# EAGLE board PKG900000001400 (EAGLE 7.7.0), part 1 of 2
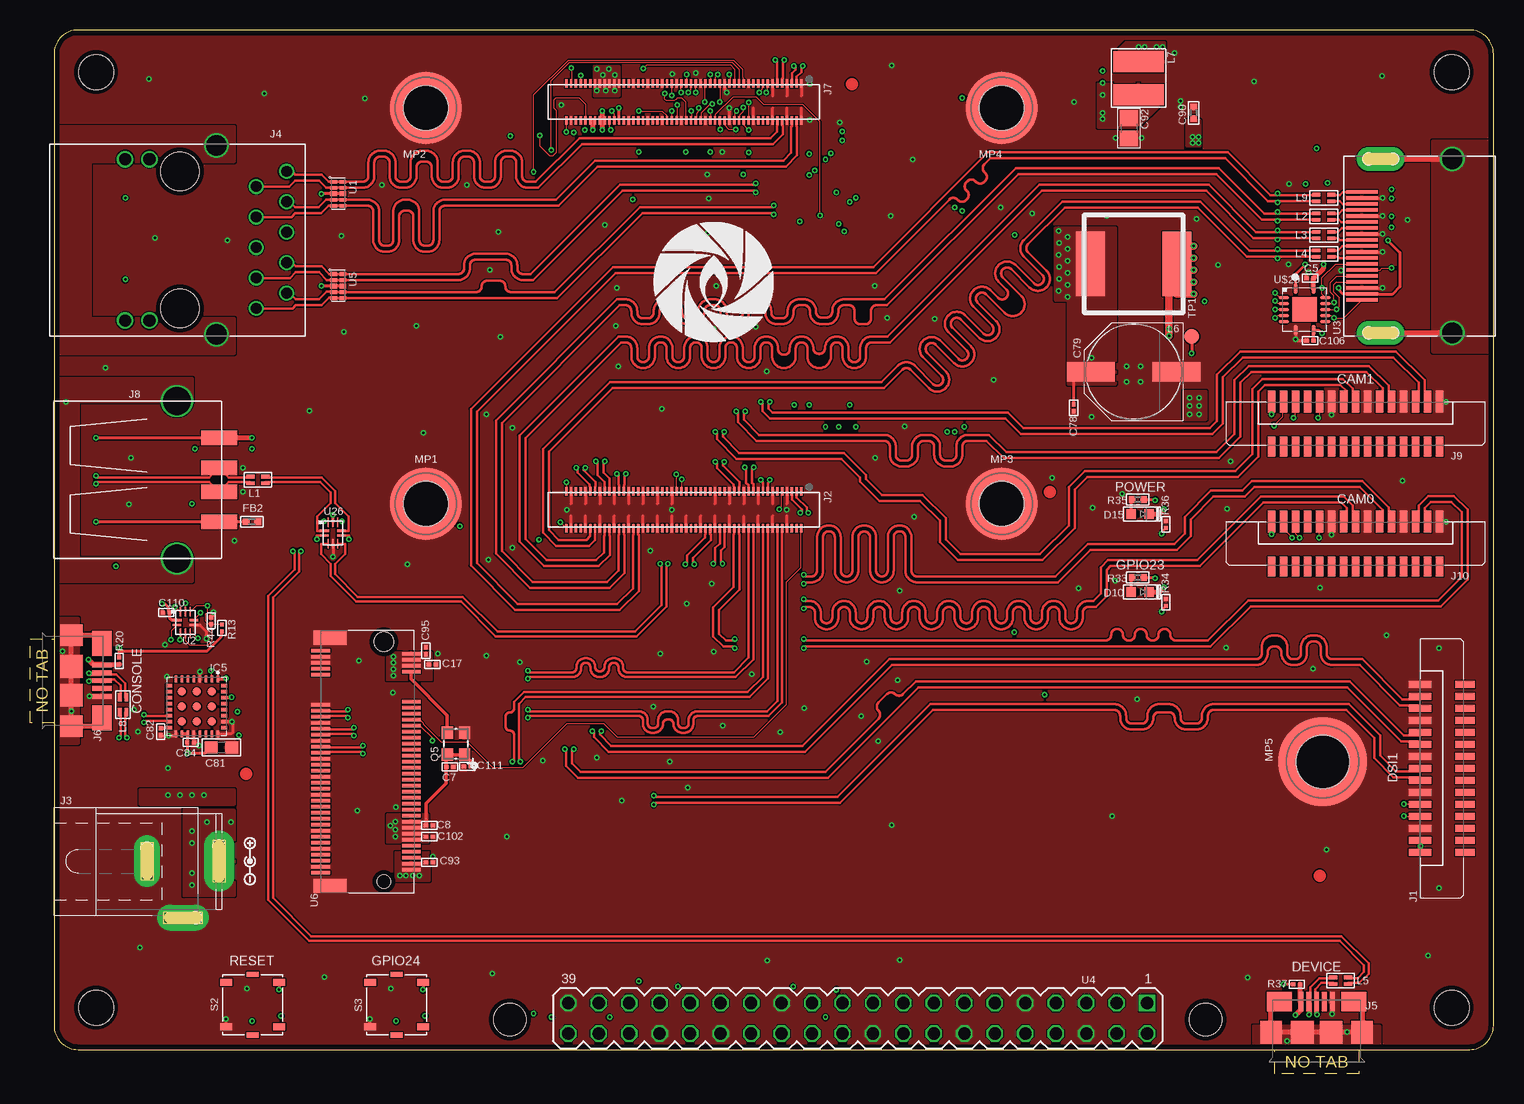
[diagram p23: board, top side]
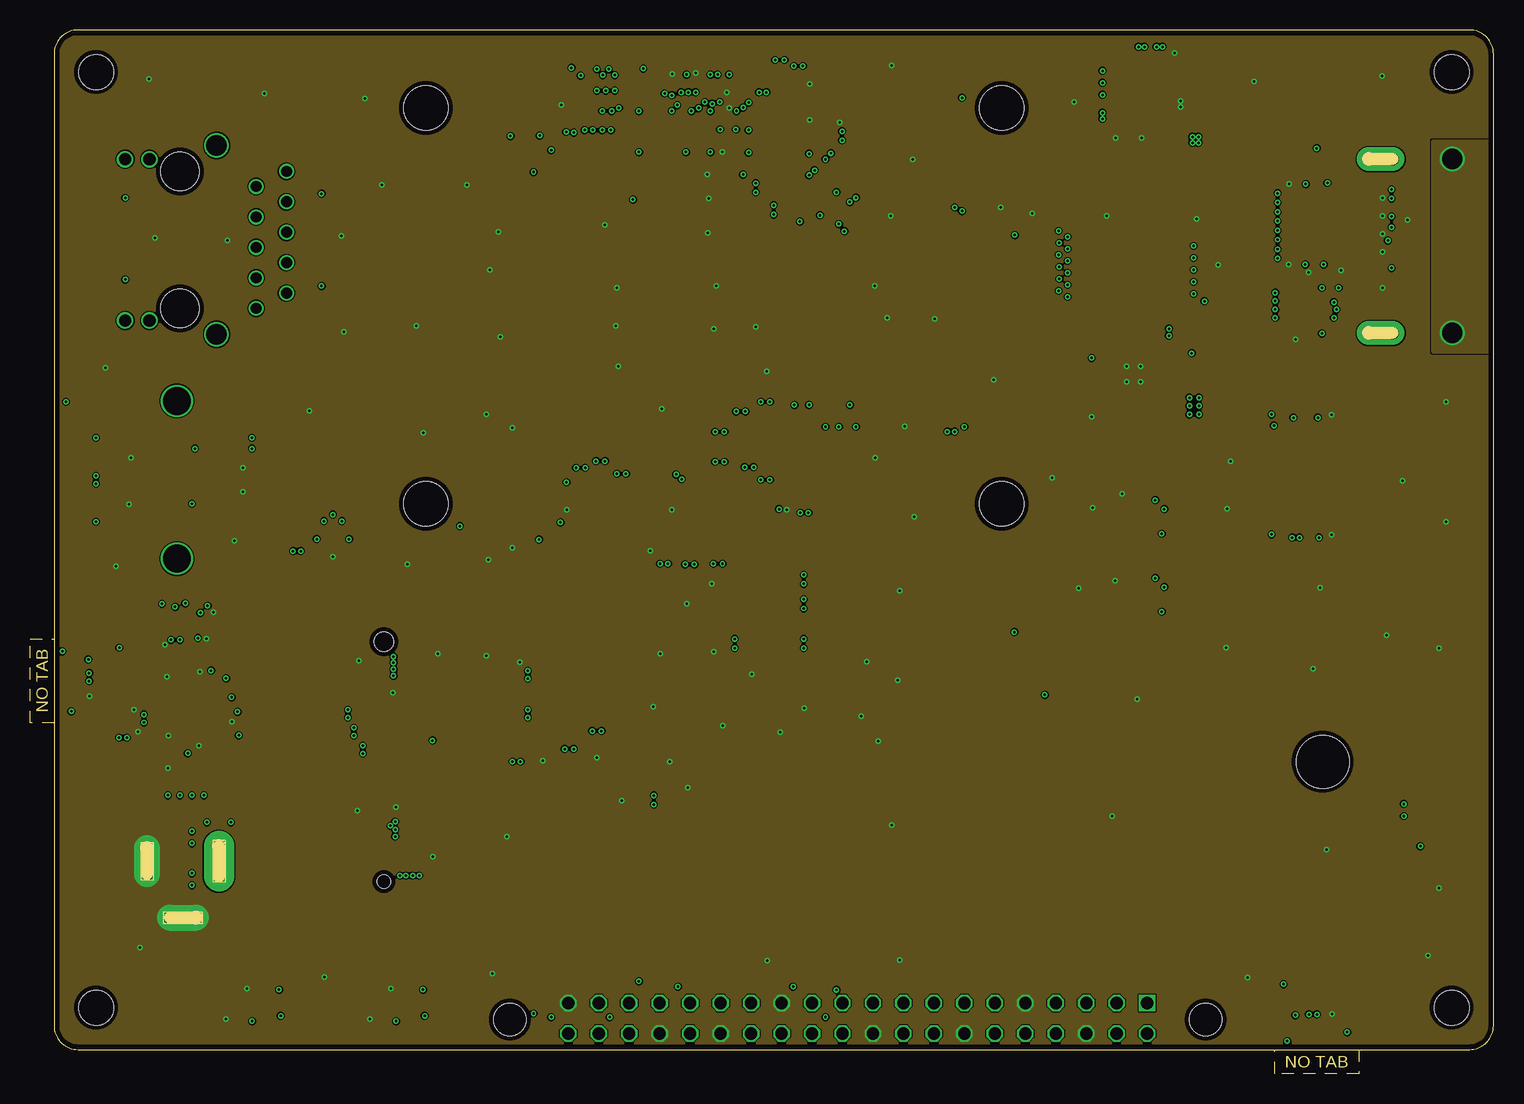
[diagram p24: board, inner layer GND]
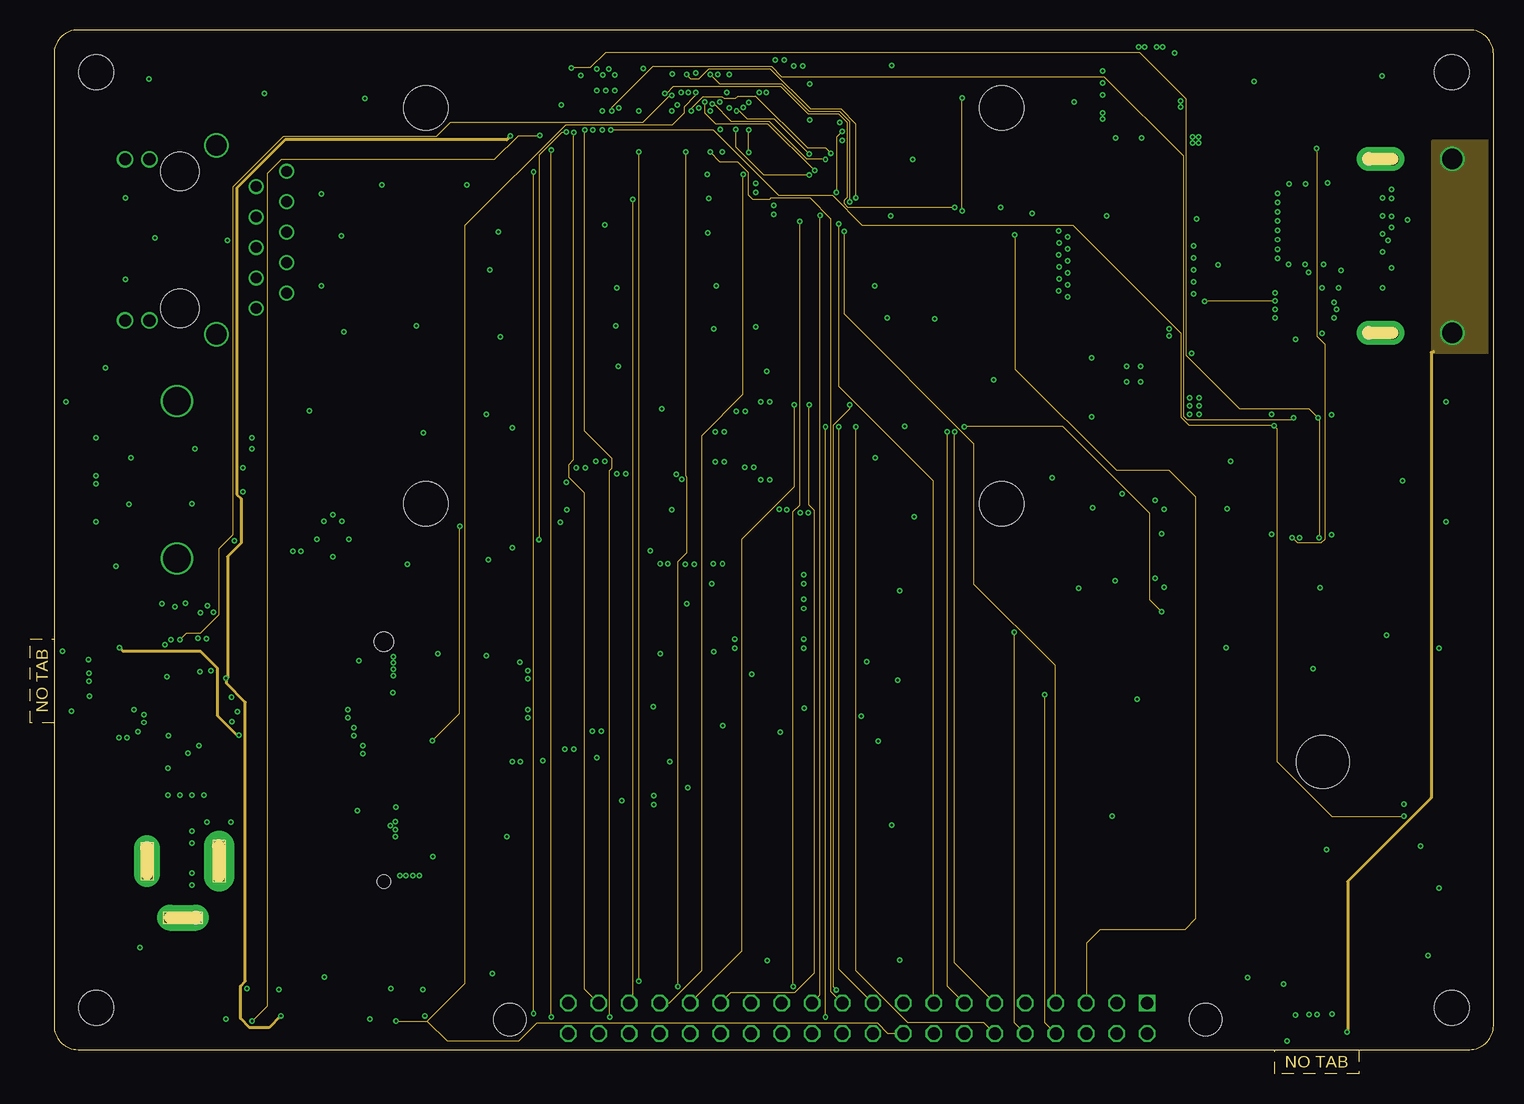
[diagram p25: board, inner layer S3]
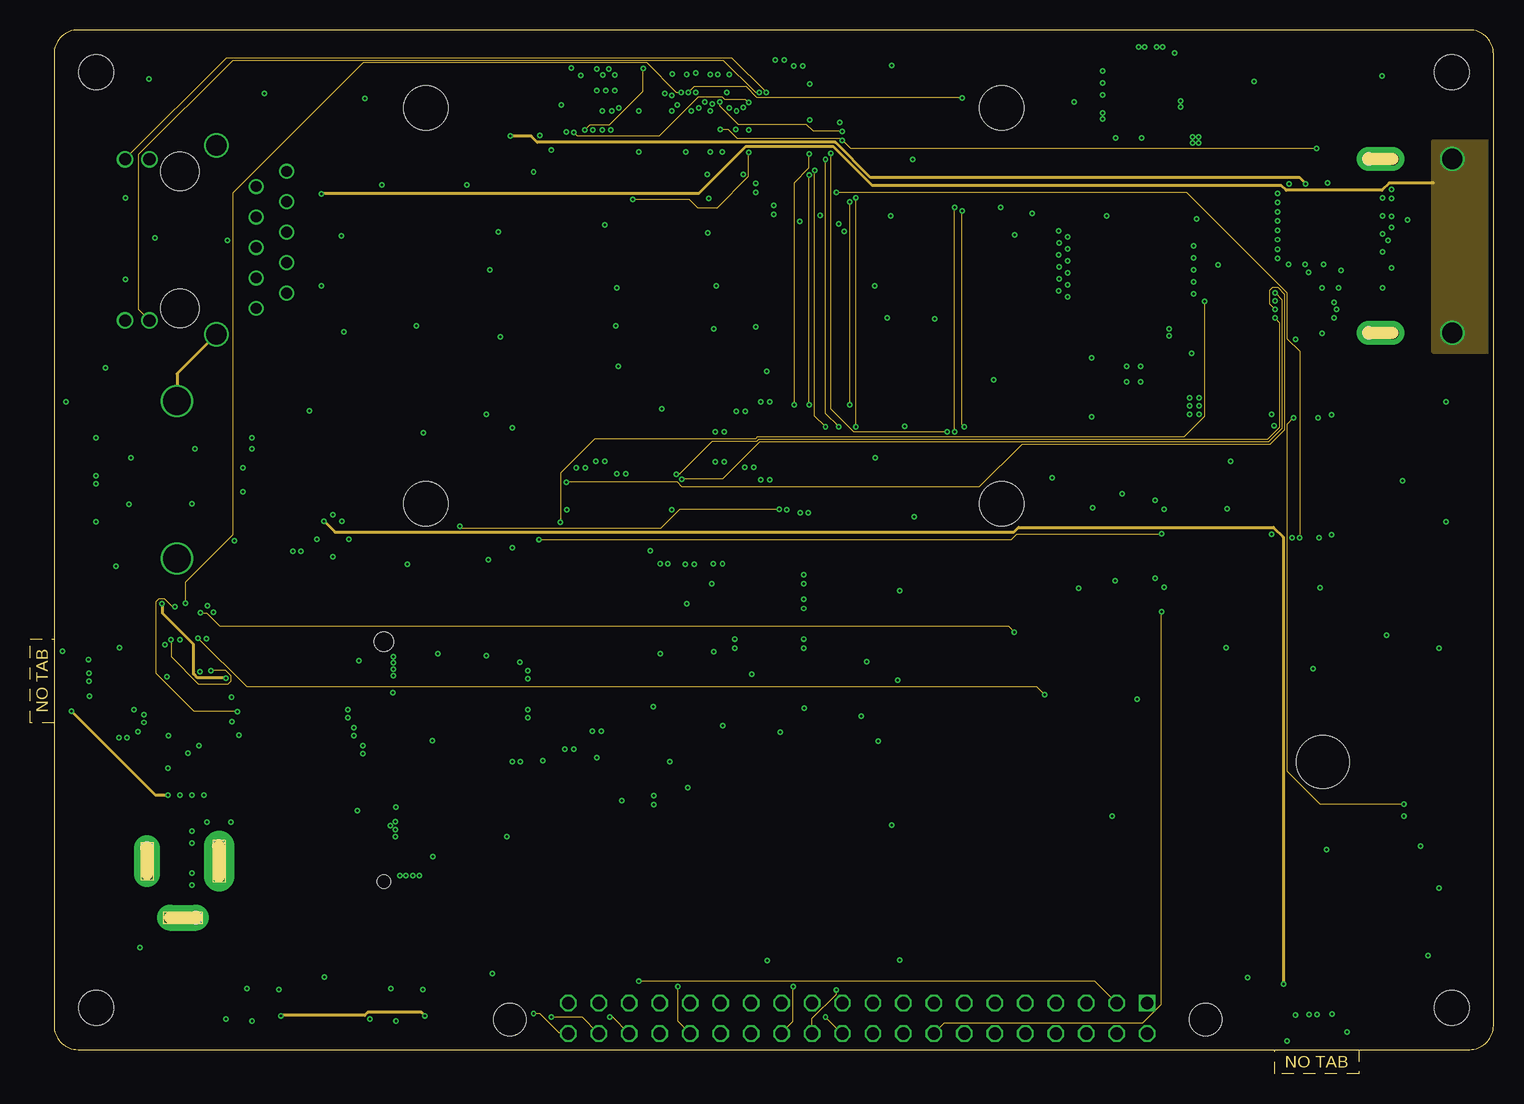
[diagram p26: board, inner layer S14]
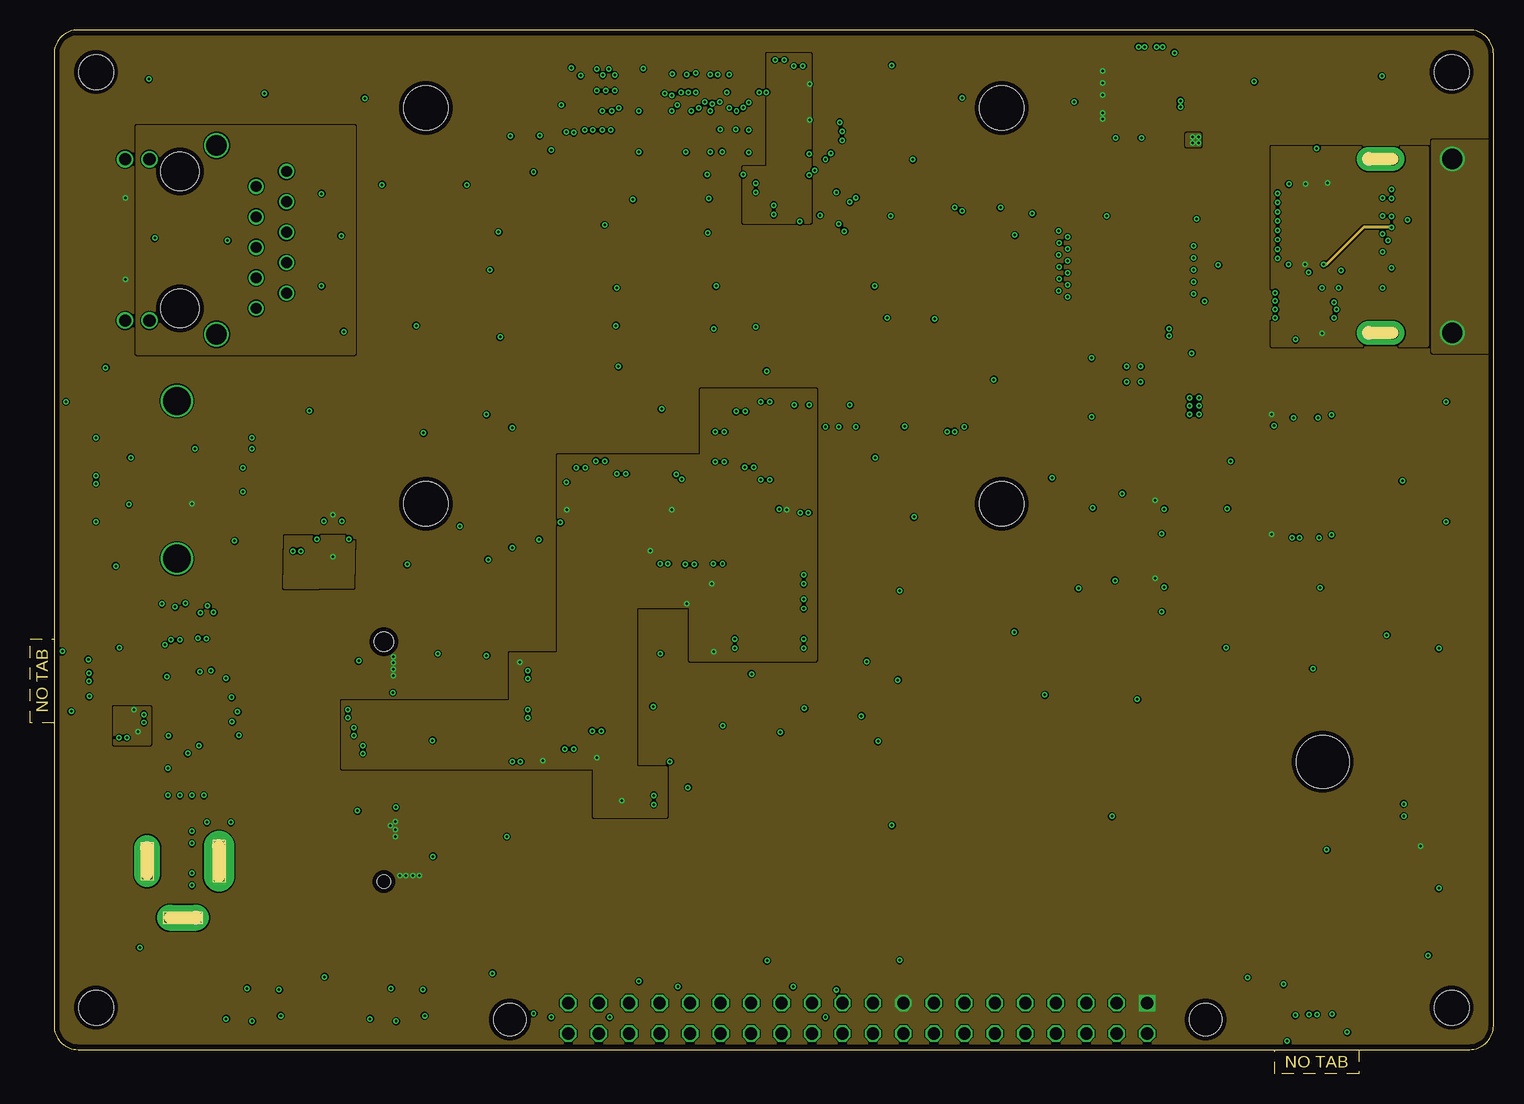
[diagram p27: board, inner layer Power]
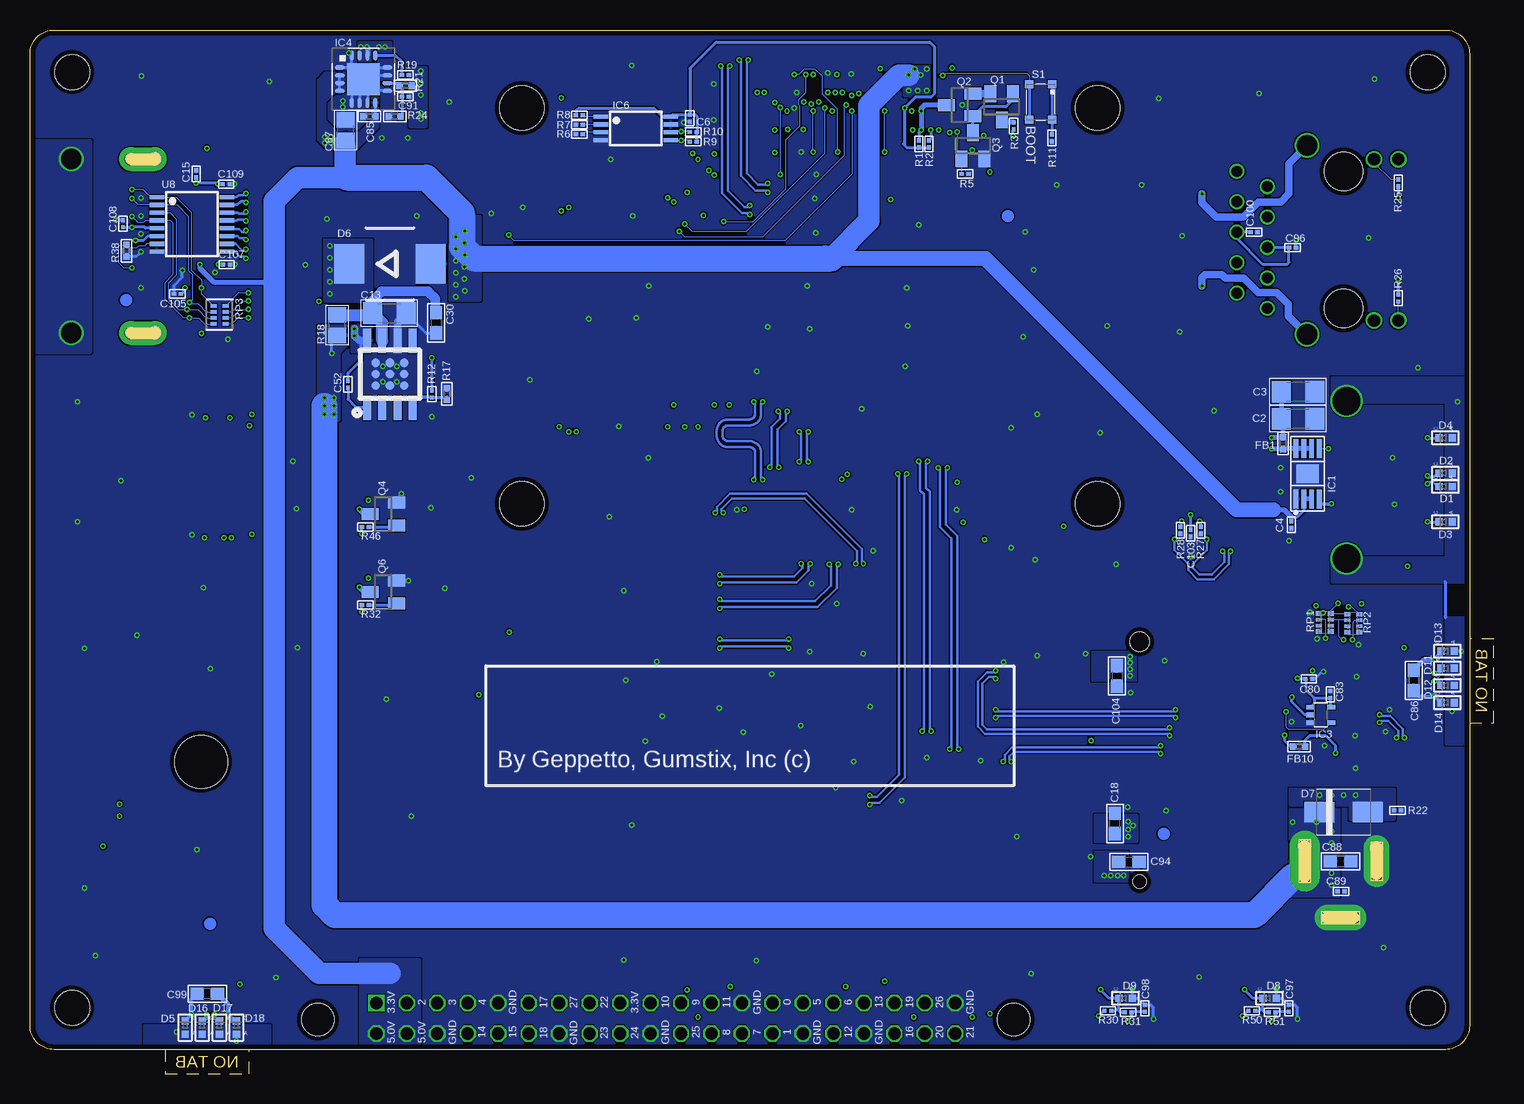
[diagram p28: board, bottom side, seen from below]

Size 122 x 87 mm. Coordinates in mm from the lower left corner, seen from the top.
Outline: 2,29.25 0,29.25 0,36.25 2,36.25
Outline: 110.75,2 110.75,0 103.75,0 103.75,2
Outline: 4,2 120,2 arc90 122,4 122,85 arc90 120,87 4,87 arc90 2,85 2,4 arc90 4,2
Copper layers (1+2*3+14*15+16): Top 0.035mm / dielectric 0.2mm / GND 0.035mm / dielectric 0.2mm / S3 0.035mm / dielectric 0.2mm / S14 0.035mm / dielectric 0.2mm / Power 0.035mm / dielectric 0.2mm / Bottom 0.035mm
Design rules "geppetto": minimum track width 4mil, minimum drill 8mil, track to track 4mil, track to pad 0.15mm, pad to pad 0.15mm, via to via 0.15mm, smd to smd 0mil, copper to edge 15mil, drill to drill 10mil, minimum pad ring 7mil, minimum via ring 5mil, stop-mask expansion 3mil, vias tented up to drill 20mil, thermal gap 0mil
Net classes: 1 supply: width 0.254 mm; 2 analog: width 0.178 mm; 4 xxwide: width 0.203 mm; 5 USB: width 0.2 mm, clearance 0.2 mm; 6 HDMI: width 0.2 mm, clearance 0.3 mm; 7 50_OHM: width 0.378 mm, clearance 0.3 mm
Holes 2.7 mm at 40,4.5 98,4.5
vRestrict: area 89.5,75 to 99,84.5

## Footprints (pad centres in the part's own frame; a part is rotated, then mirrored left to right if it is on the bottom)
1206 = smd 1.6 x 1.8: 1 -1.4,0; 2 1.4,0
0201 = smd 0.356 x 0.33: 1 -0.292,0; 2 0.292,0
0603 = smd 1.1 x 1: 1 -0.85,0; 2 0.85,0
PANASONIC_F = smd 4 x 1.6: + 3.55,0; - -3.55,0
0402 = smd 0.559 x 0.559: 1 -0.483,0; 2 0.483,0
0805 = smd 1.3 x 1.5: 1 -0.85,0; 2 0.85,0
D0402 = smd 0.6 x 0.6: P1 0,-0.55; P2 0,0.55
DO-214AB = smd 2.5 x 3.3: A 3.4,0; C -3.4,0
SMAJ = smd 2.5 x 1.7: A 2.032,0; C -2.032,0
D0603 = smd 0.8 x 0.8: A -0.75,0; C 0.75,0
MSOP8-PAD = smd 0.4 x 1.6: 1 -0.975,-2.1; 2 -0.325,-2.1; 3 0.325,-2.1; 4 0.975,-2.1; 5 0.975,2.1; 6 0.325,2.1; 7 -0.325,2.1; 8 -0.975,2.1 | smd 1.89 x 1.57: TP 0,0
SC70-5 = smd 0.4 x 0.7: 1 -0.65,-0.85; 2 0,-0.85; 3 0.65,-0.85; 4 0.65,0.85; 5 -0.65,0.85
PQFP16 = smd 0.85 x 0.35: 1 -1.975,0.975; 2 -1.975,0.325; 3 -1.975,-0.325; 4 -1.975,-0.975; 9 1.975,-0.975; 10 1.975,-0.325; 11 1.975,0.325; 12 1.975,0.975 | smd 0.35 x 0.85: 5 -0.975,-1.975; 6 -0.325,-1.975; 7 0.325,-1.975; 8 0.975,-1.975; 13 0.975,1.975; 14 0.325,1.975; 15 -0.325,1.975; 16 -0.975,1.975 | smd 2.7 x 2.7: P$1 0,0
QFN32 = smd 0.6 x 0.3: 1 -2.3,1.75; 2 -2.3,1.25; 3 -2.3,0.75; 4 -2.3,0.25; 5 -2.3,-0.25; 6 -2.3,-0.75; 7 -2.3,-1.25; 8 -2.3,-1.75; 17 2.3,-1.75; 18 2.3,-1.25; 19 2.3,-0.75; 20 2.3,-0.25; 21 2.3,0.25; 22 2.3,0.75; 23 2.3,1.25; 24 2.3,1.75 | smd 0.3 x 0.6: 9 -1.75,-2.3; 10 -1.25,-2.3; 11 -0.75,-2.3; 12 -0.25,-2.3; 13 0.25,-2.3; 14 0.75,-2.3; 15 1.25,-2.3; 16 1.75,-2.3; 25 1.75,2.3; 26 1.25,2.3; 27 0.75,2.3; 28 0.25,2.3; 29 -0.25,2.3; 30 -0.75,2.3; 31 -1.25,2.3; 32 -1.75,2.3 | smd 0.7 x 0.7: EXP1 -1.25,1.253; EXP2 1.25,1.25; EXP3 -1.25,-1.25; EXP4 1.25,-1.25; EXP5 0,1.25; EXP6 -1.25,0; EXP7 0,0; EXP8 1.25,0; EXP9 0,-1.25
TSSOP8 = smd 0.35 x 1.2: 1 -0.975,-2.925; 2 -0.325,-2.925; 3 0.325,-2.925; 4 0.975,-2.925; 5 0.975,2.925; 6 0.325,2.925; 7 -0.325,2.925; 8 -0.975,2.925
1-1734248-5 = smd 0.6 x 1.85: 1_1 7,0.025; 1_2 6,0.025; 1_3 5,0.025; 1_4 4,0.025; 1_5 3,0.025; 1_6 2,0.025; 1_7 1,0.025; 1_8 0,0.025; 1_9 -1,0.025; 1_10 -2,0.025; 1_11 -3,0.025; 1_12 -4,0.025; 1_13 -5,0.025; 1_14 -6,0.025; 1_15 -7,0.025 | smd 0.6 x 1.65: 2_1 7,-3.725; 2_2 6,-3.725; 2_3 5,-3.725; 2_4 4,-3.725; 2_5 3,-3.725; 2_6 2,-3.725; 2_7 1,-3.725; 2_8 0,-3.725; 2_9 -1,-3.725; 2_10 -2,-3.725; 2_11 -3,-3.725; 2_12 -4,-3.725; 2_13 -5,-3.725; 2_14 -6,-3.725; 2_15 -7,-3.725
HRS_DF40C-100DS-0.4V(51) = smd 0.2 x 0.7: 1 -9.8,-1.54; 2 -9.8,1.54; 3 -9.4,-1.54; 4 -9.4,1.54; 5 -9,-1.54; 6 -9,1.54; 7 -8.6,-1.54; 8 -8.6,1.54; 9 -8.2,-1.54; 10 -8.2,1.54; 11 -7.8,-1.54; 12 -7.8,1.54; 13 -7.4,-1.54; 14 -7.4,1.54; 15 -7,-1.54; 16 -7,1.54; 17 -6.6,-1.54; 18 -6.6,1.54; 19 -6.2,-1.54; 20 -6.2,1.54; 21 -5.8,-1.54; 22 -5.8,1.54; 23 -5.4,-1.54; 24 -5.4,1.54; 25 -5,-1.54; 26 -5,1.54; 27 -4.6,-1.54; 28 -4.6,1.54; 29 -4.2,-1.54; 30 -4.2,1.54; 31 -3.8,-1.54; 32 -3.8,1.54; 33 -3.4,-1.54; 34 -3.4,1.54; 35 -3,-1.54; 36 -3,1.54; 37 -2.6,-1.54; 38 -2.6,1.54; 39 -2.2,-1.54; 40 -2.2,1.54; 41 -1.8,-1.54; 42 -1.8,1.54; 43 -1.4,-1.54; 44 -1.4,1.54; 45 -1,-1.54; 46 -1,1.54; 47 -0.6,-1.54; 48 -0.6,1.54; 49 -0.2,-1.54; 50 -0.2,1.54; 51 0.2,-1.54; 52 0.2,1.54; 53 0.6,-1.54; 54 0.6,1.54; 55 1,-1.54; 56 1,1.54; 57 1.4,-1.54; 58 1.4,1.54; 59 1.8,-1.54; 60 1.8,1.54; 61 2.2,-1.54; 62 2.2,1.54; 63 2.6,-1.54; 64 2.6,1.54; 65 3,-1.54; 66 3,1.54; 67 3.4,-1.54; 68 3.4,1.54; 69 3.8,-1.54; 70 3.8,1.54; 71 4.2,-1.54; 72 4.2,1.54; 73 4.6,-1.54; 74 4.6,1.54; 75 5,-1.54; 76 5,1.54; 77 5.4,-1.54; 78 5.4,1.54; 79 5.8,-1.54; 80 5.8,1.54; 81 6.2,-1.54; 82 6.2,1.54; 83 6.6,-1.54; 84 6.6,1.54; 85 7,-1.54; 86 7,1.54; 87 7.4,-1.54; 88 7.4,1.54; 89 7.8,-1.54; 90 7.8,1.54; 91 8.2,-1.54; 92 8.2,1.54; 93 8.6,-1.54; 94 8.6,1.54; 95 9,-1.54; 96 9,1.54; 97 9.4,-1.54; 98 9.4,1.54; 99 9.8,-1.54; 100 9.8,1.54
PJ-002A = drill 1 pad 2.54 offset: 1 3,-1.27 | drill 1 pad 2.184 offset: 2 -3,-1.09; 3 -1.09,-4.7 | hole 1: 3,1.27; -3,1.09; 1.09,-4.7
7499111447 = drill 0.89: 1 5.72,-8.89; 2 4.45,-6.35; 3 3.18,-8.89; 4 1.91,-6.35; 5 0.64,-8.89; 6 -0.63,-6.35; 7 -1.9,-8.89; 8 -3.17,-6.35; 9 -4.44,-8.89; 10 -5.71,-6.35 | drill 1.02: 11 6.725,2.54; 12 6.725,4.57; 13 -6.725,2.54; 14 -6.725,4.57 | drill 1.7: 15 -7.875,-3.05; 16 7.875,-3.05 | hole 3.2: 5.715,0; -5.715,0
USB_MICRO_B = smd 2.1 x 1.6: COMMON_SHEILD1 -3.1,4; COMMON_SHEILD2 3.1,4 | smd 1.8 x 1.9: COMMON_SHEILD3 -3.8,1.45; COMMON_SHEILD6 3.8,1.45 | smd 1.9 x 1.9: COMMON_SHEILD4 -1.2,1.45; COMMON_SHEILD5 1.2,1.45 | smd 0.4 x 1.6: P1 -1.3,4; P2 -0.65,4; P3 0,4; P4 0.65,4; P5 1.3,4
USB-A-S = smd 3 x 1.2: D+ 3.5,-1; D- 3.5,1; GND 3.5,-3.5; VBUS 3.5,3.5 | drill 2.311: P$5 0,-6.566; P$6 0,6.566
0504-DLP11S = smd 0.7 x 0.3: 1 -0.625,0.275; 2 0.625,0.275; 3 0.625,-0.275; 4 -0.625,-0.275
3232DZ = smd 2.413 x 5.334: 1 -3.619,0; 2 3.619,0
1515 = smd 1.75 x 4.2: 1 -1.375,0; 2 1.375,0
WA-SMSI_9774___151 = smd 6 x 6: 1 0,0 | hole 3.7: 0,0
WA-SMSI_9774___360 = smd 7.4 x 7.4: 1 0,0 | hole 4.4: 0,0
SOT23 = smd 1 x 1.4: 1 -0.95,-1.1; 2 0.95,-1.1; 3 0,1.1
VLGA-4 = smd 1.05 x 0.95: 1 -0.925,-0.725; 2 0.925,-0.725; 3 0.925,0.725; 4 -0.925,0.725
RP741X083 = smd 0.4 x 0.5: 1 -0.75,-0.5; 4 0.75,-0.5; 5 0.75,0.5; 8 -0.75,0.5 | smd 0.3 x 0.5: 2 -0.25,-0.5; 3 0.25,-0.5; 6 0.25,0.5; 7 -0.25,0.5
741X08 = smd 0.3 x 0.5: 1 -0.75,-0.5; 2 -0.25,-0.5; 3 0.25,-0.5; 4 0.75,-0.5; 5 0.75,0.5; 6 0.25,0.5; 7 -0.25,0.5; 8 -0.75,0.5
KMT0 = smd 0.65 x 0.7: 1 -1.475,0.95; 2 1.475,0.95; 3 1.475,-0.95; 4 -1.475,-0.95
EVQ = smd 0.6 x 1: A@1 -1.85,2.2; A@2 -1.85,-2.2; B@1 1.85,2.2; B@2 1.85,-2.2 | smd 0.45 x 1: G@1 -2.525,0; G@2 2.525,0
TP0500 = smd 1.27 x 1.27: 1 0,0
UFDFN-10 = smd 0.3 x 0.55: 1 -1,-0.385; 2 -0.5,-0.385; 4 0.5,-0.385; 5 1,-0.385; 6 1,0.385; 7 0.5,0.385; 9 -0.5,0.385; 10 -1,0.385 | smd 0.4 x 0.55: 3 0,-0.385; 8 0,0.385
UQFN-10 = smd 0.2 x 0.8: 1 -0.2,-0.7; 2 0.2,-0.7; 6 0.2,0.7; 7 -0.2,0.7 | smd 0.8 x 0.2: 3 0.9,-0.4; 4 0.9,0; 5 0.9,0.4; 8 -0.9,0.4; 9 -0.9,0; 10 -0.9,-0.4
47151-001 = smd 0.3 x 2.6: 1 4.5,1.56; 2 4,1.56; 3 3.5,1.56; 4 3,1.56; 5 2.5,1.56; 6 2,1.56; 7 1.5,1.56; 8 1,1.56; 9 0.5,1.56; 10 0,1.56; 11 -0.5,1.56; 12 -1,1.56; 13 -1.5,1.56; 14 -2,1.56; 15 -2.5,1.56; 16 -3,1.56; 17 -3.5,1.56; 18 -4,1.56; 19 -4.5,1.56 | drill 1.7: G1 -7.25,-5.96; G2 7.25,-5.96 | drill 1 pad 2 offset: G3 7.25,-1; G4 -7.25,-1 | hole 1: -7.25,1; 7.25,1
2X20 = drill 1.016 square: 1 24.13,1.27 | drill 1.016 octagon: 2 24.13,-1.27; 3 21.59,1.27; 4 21.59,-1.27; 5 19.05,1.27; 6 19.05,-1.27; 7 16.51,1.27; 8 16.51,-1.27; 9 13.97,1.27; 10 13.97,-1.27; 11 11.43,1.27; 12 11.43,-1.27; 13 8.89,1.27; 14 8.89,-1.27; 15 6.35,1.27; 16 6.35,-1.27; 17 3.81,1.27; 18 3.81,-1.27; 19 1.27,1.27; 20 1.27,-1.27; 21 -1.27,1.27; 22 -1.27,-1.27; 23 -3.81,1.27; 24 -3.81,-1.27; 25 -6.35,1.27; 26 -6.35,-1.27; 27 -8.89,1.27; 28 -8.89,-1.27; 29 -11.43,1.27; 30 -11.43,-1.27; 31 -13.97,1.27; 32 -13.97,-1.27; 33 -16.51,1.27; 34 -16.51,-1.27; 35 -19.05,1.27; 36 -19.05,-1.27; 37 -21.59,1.27; 38 -21.59,-1.27; 39 -24.13,1.27; 40 -24.13,-1.27
2199230_KEY_M = smd 0.3 x 1.55: 1 -9.25,5.275; 2 -9,-2.275; 3 -8.75,5.275; 4 -8.5,-2.275; 5 -8.25,5.275; 6 -8,-2.275; 7 -7.75,5.275; 8 -7.5,-2.275; 9 -7.25,5.275; 10 -7,-2.275; 11 -6.75,5.275; 12 -6.5,-2.275; 13 -6.25,5.275; 14 -6,-2.275; 15 -5.75,5.275; 16 -5.5,-2.275; 17 -5.25,5.275; 18 -5,-2.275; 19 -4.75,5.275; 20 -4.5,-2.275; 21 -4.25,5.275; 22 -4,-2.275; 23 -3.75,5.275; 24 -3.5,-2.275; 25 -3.25,5.275; 26 -3,-2.275; 27 -2.75,5.275; 28 -2.5,-2.275; 29 -2.25,5.275; 30 -2,-2.275; 31 -1.75,5.275; 32 -1.5,-2.275; 33 -1.25,5.275; 34 -1,-2.275; 35 -0.75,5.275; 36 -0.5,-2.275; 37 -0.25,5.275; 38 0,-2.275; 39 0.25,5.275; 40 0.5,-2.275; 41 0.75,5.275; 42 1,-2.275; 43 1.25,5.275; 44 1.5,-2.275; 45 1.75,5.275; 46 2,-2.275; 47 2.25,5.275; 48 2.5,-2.275; 49 2.75,5.275; 50 3,-2.275; 51 3.25,5.275; 52 3.5,-2.275; 53 3.75,5.275; 54 4,-2.275; 55 4.25,5.275; 56 4.5,-2.275; 57 4.75,5.275; 58 5,-2.275; 67 7.25,5.275; 68 7.5,-2.275; 69 7.75,5.275; 70 8,-2.275; 71 8.25,5.275; 72 8.5,-2.275; 73 8.75,5.275; 74 9,-2.275; 75 9.25,5.275 | smd 1.2 x 2.75: P$1 -10.35,4.5; P$2 10.35,4.5 | hole 1.1: -10,0 | hole 1.6: 10,0
8SO_POWERPAD = smd 2.05 x 0.66: 1 -2.79,1.905; 2 -2.79,0.635; 3 -2.79,-0.635; 4 -2.79,-1.905; 5 2.79,-1.905; 6 2.79,-0.635; 7 2.79,0.635; 8 2.79,1.905 | smd 0.7 x 0.7: 9 0,0; PWRPAD1 -0.95,1.2; PWRPAD2 0,1.2; PWRPAD3 0.95,1.2; PWRPAD4 -0.95,0; PWRPAD5 0.95,0; PWRPAD6 -0.95,-1.2; PWRPAD7 0,-1.2; PWRPAD8 0.95,-1.2
TSSOP16 = smd 1.2 x 0.35: 1 -2.925,2.275; 2 -2.925,1.625; 3 -2.925,0.975; 4 -2.925,0.325; 5 -2.925,-0.325; 6 -2.925,-0.975; 7 -2.925,-1.625; 8 -2.925,-2.275; 9 2.925,-2.275; 10 2.925,-1.625; 11 2.925,-0.975; 12 2.925,-0.325; 13 2.925,0.325; 14 2.925,0.975; 15 2.925,1.625; 16 2.925,2.275
GEPPETTO_HOLE_2.9 = hole 2.9: 0,0
S-PVQFN-N14 = smd 0.85 x 0.28: 1 -1.725,-0.75; 7 1.725,-0.75; 8 1.725,0.75; 14 -1.725,0.75 | smd 0.28 x 0.85: 2 -1,-1.725; 3 -0.5,-1.725; 4 0,-1.725; 5 0.5,-1.725; 6 1,-1.725; 9 1,1.725; 10 0.5,1.725; 11 0,1.725; 12 -0.5,1.725; 13 -1,1.725 | smd 2.05 x 2.05: PAD 0,0

## Placement (x,y rotation side)
C2  220uF/6.3V  [1206]  16.3,54.6 0 bottom
C3  DNP  [1206]  16.3,56.85 0 bottom
C4  0.1uF  [0201]  16.85,45.75 270 bottom
C5  0.1uF  [0201]  106.7,66.3 180 top
C6  0.1uF  [0201]  67,79.65 270 bottom
C7  0.01uF  [0201]  35,25.55 0 top
C8  0.1uF  [0201]  33.3,20.7 0 top
C13  10uF/50V  [1206]  92.05,63.4 0 bottom
C15  0.1uF  [0201]  108.15,75 90 bottom
C17  0.1uF  [0201]  33.55,34.1 0 top
C18  10uF  [0603]  31.55,20.85 90 bottom
C30  10nF  [0603]  88.15,62.6 270 bottom
C52  0.01uF  [0201]  95.5,57.45 90 bottom
C78  0.01uF  [0201]  87,55.5 270 top
C79  330uF  [PANASONIC_F]  92,58.5 180 top
C80  0.1uF  [0201]  15.4,32.9 0 bottom
C81  4.7uF  [0603]  15.95,27.2 0 top
C82  0.1uF  [0201]  10.9,28.5 270 top
C83  0.1uF  [0201]  13.6,31.6 90 bottom
C84  0.1uF  [0201]  13.4,27.6 0 top
C85  0.1uF / 16V  [0402]  93.7,79.8 180 bottom
C86  4.7uF  [0603]  6.65,32.77 270 bottom
C87  10uF / 16V  [0805]  95.7,78.65 90 bottom
C88  10uF  [0603]  12.75,17.7 0 bottom
C89  0.1uF  [0201]  12.7,15.2 0 bottom
C90  1.0uF  [0402]  97,80.1 90 top
C91  10pF  [0201]  90.7,81.45 180 bottom
C92  22uF  [0805]  91.6,78.8 270 top
C93  0.1uF  [0201]  33.3,17.6 0 top
C94  10uF  [0603]  30.4,17.65 0 bottom
C95  0.1uF  [0201]  33,35.25 90 top
C96  0.1uF  [0201]  16.76,68.87 0 bottom
C97  47pF  [0201]  17.07,5.44 90 bottom
C98  47pF  [0201]  29.07,5.44 90 bottom
C99  4.7uF  [0603]  107.22,6.65 180 bottom
C100  0.1uF  [0201]  19.95,70.15 0 bottom
C102  0.1uF  [0201]  33.3,19.75 0 top
C103  0.1uF  [0201]  25.25,45.05 270 bottom
C104  10uF  [0603]  31.4,33.15 270 bottom
C105  0.1uF  [0201]  109.7,65 180 bottom
C106  0.1uF  [0201]  106.7,61.1 180 top
C107  0.01uF  [0201]  105.6,67.45 0 bottom
C108  0.1uF  [0201]  114.25,70.85 90 bottom
C109  0.01uF  [0201]  105.65,74.15 0 bottom
C110  0.1uF  [0201]  11.35,38.45 180 top
C111  0.1uF  [0201]  36.45,25.6 180 top
D1  PS04LTVA1  [D0402]  4,48.95 90 bottom
D2  PS04LTVA1  [D0402]  4,50.05 90 bottom
D3  B72590D50A060  [D0402]  4,46 90 bottom
D4  B72590D50A060  [D0402]  4,53 90 bottom
D5  B72590D50A060  [D0402]  109.08,3.83 0 bottom
D6  CDBC540-G  [DO-214AB]  92,67.5 0 bottom
D7  824501401  [SMAJ]  12.5,21.79 0 bottom
D8  B72590D50A060  [D0402]  18.66,6.28 90 bottom
D9  B72590D50A060  [D0402]  30.66,6.28 90 bottom
D10  RED  [D0603]  92.55,40.15 0 top
D11  PS04LTVA1  [D0402]  3.83,33.78 90 bottom
D12  PS04LTVA1  [D0402]  3.83,32.36 90 bottom
D13  B72590D50A060  [D0402]  3.83,35.2 90 bottom
D14  B72590D50A060  [D0402]  3.83,30.93 90 bottom
D15  GREEN  [D0603]  92.55,46.65 0 top
D16  PS04LTVA1  [D0402]  107.64,3.83 0 bottom
D17  PS04LTVA1  [D0402]  106.22,3.83 0 bottom
D18  B72590D50A060  [D0402]  104.8,3.83 0 bottom
FB1  120R 1A  [0402]  17.55,52.55 90 bottom
FB2  120R 1A  [0402]  18.5,46 180 top
FB10  120R 1A  [0402]  16.2,27.25 0 bottom
FD1  DNP  [FIDUCIAL]  18,25 0 top
FD2  DNP  [FIDUCIAL]  68.5,82.5 0 top
FD3  DNP  [FIDUCIAL]  107.5,16.5 0 top
FD4  DNP  [FIDUCIAL]  85,48.5 0 top
FD5  DNP  [FIDUCIAL]  27.5,20 0 bottom
FD6  DNP  [FIDUCIAL]  40.5,71.5 0 bottom
FD7  DNP  [FIDUCIAL]  114,64.5 0 bottom
FD8  DNP  [FIDUCIAL]  107,12.5 0 bottom
IC1  TPS2051  [MSOP8-PAD]  15.5,50 0 bottom
IC3  SN74LVC1G126DCKR  [SC70-5]  14.4,29.9 270 bottom
IC4  TPS62111  [PQFP16]  94.2,82.9 0 bottom
IC5  FT232RQ  [QFN32]  13.9,30.6 270 top
IC6  CAT24C256YI-G  [TSSOP8]  71.5,78.8 270 bottom
J1  FPC-15VERT  [1-1734248-5]  115.9,25.45 90 top
J2  DF40C-100DS-0.4V(51)  [HRS_DF40C-100DS-0.4V(51)]  54.5,47 180 top
J3  PJ-002A  [PJ-002A]  12.75,17.7 0 top
J4  1000BASET  [7499111447]  12.5,69.5 90 top
J5  USB_MICRO_B  [USB_MICRO_B]  107.25,2 0 top
J6  USB_MICRO_B  [USB_MICRO_B]  2,32.75 270 top
J7  DF40C-100DS-0.4V(51)  [HRS_DF40C-100DS-0.4V(51)]  54.5,81 180 top
J8  USB-A-S  [USB-A-S]  12.25,49.5 0 top
J9  FPC-15VERT  [1-1734248-5]  110.5,56 0 top
J10  FPC-15VERT  [1-1734248-5]  110.5,46 0 top
L1  DLP11SN900HL2  [0504-DLP11S]  19,49.5 0 top
L2  DLP11SN900HL2  [0504-DLP11S]  107.85,71.45 180 top
L3  DLP11SN900HL2  [0504-DLP11S]  107.85,69.9 180 top
L4  DLP11SN900HL2  [0504-DLP11S]  107.85,68.35 180 top
L5  DLP11SN900HL2  [0504-DLP11S]  109.25,7.75 0 top
L6  10uH  [3232DZ]  92,67.5 180 top
L7  6.8uH  [1515]  92.4,83 270 top
L8  DLP11SN900HL2  [0504-DLP11S]  7.75,30.75 270 top
L9  DLP11SN900HL2  [0504-DLP11S]  107.85,73 180 top
MP1  9774015151R  [WA-SMSI_9774___151]  33,47.5 0 top
MP2  9774015151R  [WA-SMSI_9774___151]  33,80.5 0 top
MP3  9774015151R  [WA-SMSI_9774___151]  81,47.5 0 top
MP4  9774015151R  [WA-SMSI_9774___151]  81,80.5 0 top
MP5  9774025360R  [WA-SMSI_9774___360]  107.75,26 90 top
Q1  [SOT23]  43.4,77.35 0 bottom
Q2  FDN360P  [SOT23]  44.5,80.75 90 bottom
Q3  FDN360P  [SOT23]  41,80.6 180 bottom
Q4  BSS138  [SOT23]  92.55,46.65 90 bottom
Q5  32.768kHz  [VLGA-4]  35.5,27.5 90 top
Q6  BSS138  [SOT23]  92.55,40.15 90 bottom
R1  0R  [0201]  47.9,77.5 270 bottom
R2  DNP  [0201]  47.05,77.5 270 bottom
R3  0R  [0201]  40,79 90 bottom
R5  10K 1%  [0201]  44.05,75 180 bottom
R6  100K 1%  [0201]  76.2,78.3 0 bottom
R7  100K 1%  [0201]  76.2,79.1 0 bottom
R8  100K 1%  [0201]  76.2,79.9 0 bottom
R9  1K5  [0201]  66.7,77.7 0 bottom
R10  1K5  [0201]  66.7,78.5 0 bottom
R11  10K 1%  [0201]  36.8,78 90 bottom
R12  100K 1%  [0201]  88.5,56.65 270 bottom
R13  10K 1%  [0201]  16,37.15 270 top
R17  31K6  [0402]  87.25,56.65 90 bottom
R18  0R  [0805]  96.4,62.4 90 bottom
R19  1M0  [0201]  90.7,83.25 0 bottom
R20  0R  [0201]  7.45,34.4 270 top
R21  0R  [0402]  90.7,82.35 0 bottom
R22  0R  [0201]  8,21.95 180 bottom
R24  DNP  [0402]  91.6,79.8 0 bottom
R25  330R  [0201]  7.93,74.25 90 bottom
R26  330R  [0201]  7.93,64.64 270 bottom
R27  10K 1%  [0201]  24.4,45.3 90 bottom
R28  10K 1%  [0201]  26.1,45.3 90 bottom
R30  10K 1%  [0201]  32.15,5.22 180 bottom
R31  150R  [0201]  30.46,5.11 0 bottom
R32  1K  [0201]  94.05,39.05 0 bottom
R33  300R  [0402]  92.35,41.35 0 top
R34  100K 1%  [0201]  94.69,39.28 270 top
R35  300R  [0402]  92.35,47.85 0 top
R36  100K 1%  [0201]  94.69,45.78 270 top
R37  0R  [0201]  105.6,7.45 0 top
R38  75R  [0402]  113.95,68.6 90 bottom
R44  10K 1%  [0201]  15.1,37.75 270 top
R46  1K  [0201]  94.05,45.55 0 bottom
R50  10K 1%  [0201]  20.15,5.22 180 bottom
R51  150R  [0201]  18.46,5.11 0 bottom
RP1  DNP  [RP741X083]  14.05,37.6 270 bottom
RP2  DNP  [RP741X083]  11.7,37.55 90 bottom
RP3  DNP  [741X08]  106.2,63.25 90 bottom
S1  EVQ  [KMT0]  37.75,81 270 bottom
S2  EVQ  [EVQ]  18.55,5.75 90 top
S3  EVQ  [EVQ]  30.55,5.75 90 top
TP1  DNP  [TP0500]  96.85,61.45 0 top
U1  TPD4E02B0410-USON  [UFDFN-10]  25.7,73.35 270 top
U2  TS3A5223  [UQFN-10]  12.95,37.6 270 top
U3  HDMI  [47151-001]  112.6,69 90 top
U4  MALE  [2X20]  69,4.6 0 top
U5  TPD4E02B0410-USON  [UFDFN-10]  25.7,65.65 270 top
U6  M2_KEY_M  [2199230_KEY_M]  29.5,26 90 top
U7  TPS5450  [8SO_POWERPAD]  92,58.3 90 bottom
U8  TPD13S523TSSOP  [TSSOP16]  108.5,70.8 0 bottom
U26  TS3USB30  [UQFN-10]  25.25,45.05 270 top
U$3  DNP  [GEPPETTO_LABEL]  84,24 0 bottom
U$4  DNP  [GEPPETTO_LOGO_SILK10]  57,66 0 top
U$6  DNP  [TIP_POSITIVE_LABEL]  19,17.7 90 top
U$14  DNP  [GEPPETTO_HOLE_2.9]  118.5,83.5 0 top
U$16  DNP  [GEPPETTO_HOLE_2.9]  5.5,83.5 0 top
U$18  DNP  [GEPPETTO_HOLE_2.9]  118.5,5.5 0 top
U$20  DNP  [GEPPETTO_HOLE_2.9]  5.5,5.5 0 top
U$29  [S-PVQFN-N14]  106.25,63.7 270 top

## Tracks (layer width: path | path; a pad name or v marks a point on that pad's centre or on a via)
1.8V_OUT$19  (via drill 0.2)
  Top 0.254: 46.9,79.46 J7.88 J7.90
  Top 0.406: 46.9,79.46 v46.9,78.65
  Bottom 0.254: v46.9,78.65 46.9,77.94 R2.1
1.USB_DEVICE_D_N  (via drill 0.2)
  Top 0.2: L8.2 7.95,30.12 7.95,28 v8.08,28 | v9.5,29.27 9.5,29.4 11.6,29.4 IC5.15
  Bottom 0.2: v8.08,28 7.95,28 7.95,28.57 8.78,29.4 9.5,29.4 v9.5,29.27
1.USB_DEVICE_D_P  (via drill 0.2)
  Top 0.2: L8.3 7.55,30.12 7.55,28 v7.42,28 | v9.5,29.93 9.5,29.8 11.6,29.8 IC5.14
  Bottom 0.2: v7.42,28 7.55,28 7.55,28.73 8.62,29.8 9.5,29.8 v9.5,29.93
1.USB_DEVICE_VBUS  (via drill 0.2, 0.2 pad 0.46)
  Top 0.254: R20.1 7.45,35.22 | 7.45,35.22 v7.45,35.5 | 7.45,35.22 14.75,35.22 15.97,36.44 15.97,36.85 R13.2
  S3 0.254: v17.4,28.2 17.39,28.21 17.24,28.21 15.61,29.84 15.61,33.8 14.19,35.22 7.74,35.22 7.49,35.48 v7.45,35.5
  Bottom 0.254: FB10.1 16.9,27.25 17.4,27.75 v17.4,28.2
2.5.0V_VCC_5.0  (via drill 0.2, 0.2 pad 0.25)
  Top 0.254: C78.1 87,58.5
  Top 0.406: U$29.14 C5.1 107.85,67.16 v107.85,67.45
  Top 0.61: 88.38,58.5 C79.+ 87,58.5
  Power 0.254: v113.5,70.55 111.17,70.55 108.08,67.45 v107.85,67.45
  Bottom 0.254: R12.1 v88.5,59.65 | 93.25,80.9 IC4.8 93.22,80.92 C85.1 | IC4.2 IC4.3 IC4.4 | U8.5 112.38,70.47 112.45,70.55 v113.5,70.55 C108.1 | IC1.2 15.82,46.94 16.37,46.4 16.85,46.4 C4.1
  Bottom 0.406: v96.9,77.6 96.7,77.8 C87.1 95.8,77.7 | IC1.3 IC1.2 | 16.85,46.4 17.45,47 18.35,47 | v107.85,67.45 107.85,67.15 106.7,66 101.7,66 101.65,66.05
  Bottom 1.27: 18.35,47 21.4,47 42.35,67.95 55.7,67.95
  Bottom 1.778: 55.2,67.95 52.05,71.1 52.05,80.75 49.56,83.24 v48.75,83.24 | 92,8.35 97.9,8.35 101.65,12.1 101.65,66.05 101.65,72.75 99.7,74.7 95.6,74.7 95.75,74.85 95.75,77.25
  Bottom 2.184: 55.2,67.95 55.7,67.95 85,67.95 86,68.95 86,71.75 88.95,74.7 95.6,74.7
  other vias: 97.4,78.1 97.4,77.6 96.9,78.1 47.25,83.74 47.75,83.24 48.25,83.74 48.75,81.94 48,81.94 47.25,81.94 85.75,65.25 86.5,65.75 85.8,66.25 86.5,66.75 85.8,67.25 86.5,67.75 85.75,68.25 86.5,68.75 86.5,69.75 85.75,70.25 85.8,69.25 86.5,64.75
  pour Top: 90.5,70.5 85.45,70.5 85.45,64.5 86.5,64.5 86.5,57.5 90.5,57.5
  pour Bottom: 93,81.4 93.5,81.4 93.5,79.46 94.56,78.4 96.37,78.4 97.4,79.43 97.4,81.02 96.62,81.8 95.7,81.8 95.7,83.4 97.43,83.4 98,82.83 98,77.87 97.28,77.15 94.74,77.15 93,78.89
  pour Power: 96.45,78.35 97.5,78.35 97.5,77.3 96.45,77.3
  pour Top: 96.45,77.3 96.45,79.5 97.5,79.5 97.5,77.3
  pour Top (rank 3): 47.05,81.5 47.05,84 49.1,84 49.1,81.5
  pour Bottom: 47.05,81.5 49.1,81.5 49.1,84 47.05,84
  pour Bottom: 89.5,9.5 94.5,9.5 94.5,2.5 89.5,2.5
  pour Bottom: 87,64.45 87,71.5 84.5,71.5 84.5,64.45
3.3.3V_VCC_3.3  (via drill 0.2)
  Top 0.254: R33.2 93.75,41.35 v93.8,41.3 | R35.2 93.75,47.85 v93.8,47.8 | U26.9 v25.25,46.6 | J9.1_15 v103.5,54.95 | J10.1_15 v103.5,44.95
  Top 0.305: C8.1 33.01,22.51 34.7,24.2 C7.1 34.71,26.51 Q5.4 Q5.1 36.74,26.06 C111.1
  Top 0.406: J1.1_15 115.88,18.95 | J1.1_14 115.88,18.95 | 115.88,18.95 v115.9,18.95
  Bottom 0.254: C103.1 v25.25,46.6
  Bottom 0.305: R25.1 7.95,73.96 v7.95,73 | R26.1 7.95,64.93 v7.95,66.2 | IC1.4 14.53,47.5 v13.5,47.5
  other vias: 89.4,83.6 89.4,82.6 89.4,81.6 89.4,80.1 89.4,79.6 31.35,16.5 31.9,16.5 32.45,16.5 30.45,19.75 30.45,20.35 30.45,21 30.3,34.75 30.3,34.25 30.3,33.7 30.85,16.5 30.05,20.65 30.3,33.15
  pour Top: 94.3,82.5 89,82.5 89,78.9 92.37,78.9 94.3,80.83
  pour Bottom: 90.3,83.9 89,83.9 89,78.9 90.3,78.9
  pour Power (rank 3): 112,14.5 112,37.5 23,37.5 23,14.5
  pour Top: 30.5,16.05 30.5,18.45 33.25,18.45 33.25,16.05
  pour Bottom: 30.5,16.05 30.5,18.45 33.25,18.45 33.25,16.05
  pour Top: 29.75,19.3 33.2,19.3 33.2,21.55 29.75,21.55
  pour Bottom: 29.75,19.3 33.2,19.3 33.2,21.55 29.75,21.55
  pour Top: 29.8,32.8 29.8,35.1 33.45,35.1 33.45,32.8
  pour Bottom: 29.8,32.8 29.8,35.1 33.45,35.1 33.45,32.8
  pour Power: 99.5,51.5 121.5,51.5 121.5,57 99.5,57
  pour Power: 99.5,41.5 121.5,41.5 121.5,47 99.5,47
  pour Power (rank 3): 120.7,14.7 120.7,36.2 114.7,36.2 114.7,14.7
  pour Power (rank 6): 2,2 2,87 122,87 122,2
3.3V_OUT$19  (via drill 0.2)
  Top 0.254: 47.7,79.46 J7.86 J7.84 47.7,79.66
  Top 0.406: 47.7,79.46 v47.7,78.65 | v47.7,80.25 47.7,79.66
  Bottom 0.254: v47.7,78.65 47.9,78.45 R1.1
  Bottom 0.406: Q2.3 47.45,80.75 47.7,80.5 v47.7,78.65
5.5.5-36V_VCC_BATT  (via drill 0.2)
  Top 0.254: TP1.1 v96.85,60.05
  Bottom 0.254: v96.85,60.05 96.85,61.66
  Bottom 2.184: v97.45,55.65 97.45,14.05 96.6,13.2 19.95,13.2 16.72,16.43 J3.1
  other vias: 96.65,56.35 96.65,55.65 97.45,56.35 96.65,54.95 97.45,54.95 13.5,15.7 13.5,16.7 13.5,19.2 13.5,20.2 16.75,20.95 14.75,20.95
  pour Bottom: 95.6,62.3 98,62.3 98,54.5 96.2,54.5 96.2,60.1 95.6,60.7
  pour Top: 96.2,54.5 96.2,56.9 98,56.9 98,54.5
  pour Bottom (rank 3): 17,14.8 12.85,14.8 12.85,22 17,22
  pour Top (rank 3): 17,14.8 12.85,14.8 12.85,22 17,22
18.UART1_RXD  (via drill 0.2)
  Top 0.102: U2.7 14.2,38.35 v14.2,38.4
  S3 0.102: v82.06,36.8 82.06,4.23 82.92,3.37 U4.10
  S14 0.102: v82.06,36.8 81.6,37.26 15.87,37.26 14.75,38.37 14.24,38.37 v14.2,38.4
  Bottom 0.102: RP1.1 arc90 14.5,38.4 v14.2,38.4
18.UART1_TXD  (via drill 0.2)
  Top 0.102: U2.5 13.6,36.7 v14,36.3
  S3 0.102: v84.6,31.57 84.6,4.23 85.46,3.37 U4.8
  S14 0.102: v84.6,31.57 83.94,32.23 18.1,32.23 14.04,36.29 v14,36.3
  Bottom 0.102: v14,36.3 14,37.8 14.05,37.85 RP1.2
18.UART2_RXD  (via drill 0.2, 0.2 pad 0.46)
  Top 0.102: U2.10 12.5,38.5 v12.1,38.9
  S14 0.102: v12.1,38.9 12.06,38.93 11.86,38.93 11.2,39.59 10.79,39.59 10.53,39.34 10.53,33.34 13.68,30.19 17.29,30.19 v17.3,30.15
  Bottom 0.102: v17.3,30.15 17.3,28.9 17.07,28.67 14.13,28.67 IC3.4 | v12.1,38.9 11.8,38.9 RP2.4
18.UART2_TXD  (via drill 0.2, 0.2 pad 0.46)
  Top 0.102: v15.1,33.6 15.15,33.55 IC5.2 | U2.2 11.75,36.9 v11.75,36.15
  S14 0.102: v15.1,33.6 v15.11,33.6 16.33,33.6 16.78,33.14 16.78,32.73 16.53,32.48 14.04,32.48 11.75,34.77 11.75,36.14 v11.75,36.15
  Bottom 0.102: v11.75,36.15 11.7,36.2 11.7,37.65 11.55,37.8 RP2.3
19.3.3V_VCC_3.3
  Bottom 0.406: R3.2 40.79,79.29 Q3.3
19.1000BASET_LINK_1000  (via drill 0.2)
  Top 0.102: v60.78,81.81 61.08,82.11 61.08,82.52 J7.17
  S14 0.102: v60.78,81.81 60.47,81.81 57.78,84.5 16.94,84.5 9.06,76.62 9.06,63.67 9.93,62.81 J4.13
19.1000BASET_LINK_ACT  (via drill 0.2)
  Top 0.102: v61.38,81.81 61.49,81.91 61.49,82.52 J7.15
  S14 0.102: v61.38,81.81 58.49,84.7 16.38,84.7 7.94,76.27 J4.12
19.1000BASET_LINK_ACT__
  Bottom 0.102: R25.2 7.94,74.54 8.55,74.54 9.93,75.91 9.93,76.22 J4.11
19.1000BASET_TR0_N
  Top 0.2: J4.2 21.62,73.95 22.12,74.45 24.1,74.45 24.7,73.85 U1.2 U1.9 27.73,73.85 arc90 28.71,74.83 28.71,75.96 arc-90 29.18,76.44 29.49,76.44 arc-90 29.97,75.96 29.97,74.83 arc90 30.94,73.85 31.25,73.85 arc90 32.23,74.83 32.23,75.55 arc-90 32.7,76.02 33.01,76.02 arc-90 33.49,75.55 33.49,74.83 arc90 34.46,73.85 34.77,73.85 arc90 35.75,74.83 35.75,75.96 arc-90 36.22,76.44 36.53,76.44 arc-90 37.01,75.96 37.01,74.83 arc90 37.98,73.85 38.29,73.85 arc90 39.27,74.83 39.27,75.96 arc-90 39.74,76.44 40.05,76.44 arc-90 40.52,75.96 40.52,74.83 arc90 41.5,73.85 42.35,73.85 46,77.5 61.95,77.5 62.75,78.3 62.75,79 62.7,79.05 J7.10
19.1000BASET_TR0_P
  Top 0.2: J4.1 21.85,75.22 22.12,74.95 24.3,74.95 24.9,74.35 U1.1 U1.10 27.73,74.35 arc90 28.21,74.83 28.21,75.96 arc-90 29.18,76.94 29.49,76.94 arc-90 30.47,75.96 30.47,74.83 arc90 30.94,74.35 31.25,74.35 arc90 31.73,74.83 31.73,75.96 arc-90 32.7,76.94 33.01,76.94 arc-90 33.99,75.96 33.99,74.83 arc90 34.46,74.35 34.77,74.35 arc90 35.25,74.83 35.25,75.96 arc-90 36.22,76.94 36.53,76.94 arc-90 37.51,75.96 37.51,74.83 arc90 37.98,74.35 38.29,74.35 arc90 38.77,74.83 38.77,75.96 arc-90 39.74,76.94 40.05,76.94 arc-90 41.02,75.96 41.02,74.83 arc90 41.5,74.35 42.15,74.35 45.8,78 61.75,78 62.25,78.5 62.25,79 62.3,79.05 J7.12
19.1000BASET_TR1_N
  Top 0.2: J4.3 21.67,72.68 22.12,72.23 24.08,72.23 24.7,72.85 U1.4 U1.7 28.13,72.85 arc-90 29.11,71.88 29.11,69.48 arc90 29.58,69.01 29.8,69.01 arc90 30.28,69.48 30.28,71.88 arc-90 31.25,72.85 31.48,72.85 arc-90 32.45,71.88 32.45,69.48 arc90 32.93,69.01 33.15,69.01 arc90 33.62,69.48 33.62,71.88 arc-90 34.6,72.85 43.85,72.85 47.1,76.1 62.8,76.1 63.45,76.75 63.45,78.95 63.5,79 J7.6
19.1000BASET_TR1_P
  Top 0.2: J4.4 21.8,71.41 22.12,71.73 24.28,71.73 24.9,72.35 U1.5 U1.6 28.13,72.35 arc-90 28.61,71.88 28.61,69.48 arc90 29.58,68.51 29.8,68.51 arc90 30.78,69.48 30.78,71.46 arc-90 31.25,71.94 31.48,71.94 arc-90 31.95,71.46 31.95,69.48 arc90 32.93,68.51 33.15,68.51 arc90 34.12,69.48 34.12,71.88 arc-90 34.6,72.35 44.05,72.35 47.3,75.6 63,75.6 63.95,76.55 63.95,78.95 63.9,79 J7.4
19.1000BASET_TR2_N  (via drill 0.2)
  Top 0.2: J4.8 21.68,66.33 22.15,66.8 24.1,66.8 24.75,66.15 U5.2 U5.9 35.7,66.15 arc90 36.68,67.12 36.68,67.38 arc-90 37.15,67.85 39.65,67.85 arc-90 40.12,67.38 40.12,67.12 arc90 41.1,66.15 41.95,66.15 49.4,73.6 60.5,73.6 v60.5,73.47 | v62.88,84.5 62.75,84.5 62.75,83 62.7,82.95 J7.9
  Bottom 0.2: v60.5,73.47 60.5,73.6 61.5,73.6 62.75,74.85 62.75,84.5 v62.88,84.5
19.1000BASET_TR2_P  (via drill 0.2)
  Top 0.2: J4.7 21.85,67.6 22.15,67.3 24.3,67.3 24.95,66.65 U5.1 U5.10 35.7,66.65 arc90 36.18,67.12 36.18,67.38 arc-90 37.15,68.35 39.65,68.35 arc-90 40.62,67.38 40.62,67.12 arc90 41.1,66.65 41.75,66.65 49.2,74.1 60.5,74.1 v60.5,74.23 | v62.12,84.5 62.25,84.5 62.25,83 62.3,82.95 J7.11
  Bottom 0.2: v60.5,74.23 60.5,74.1 61.3,74.1 62.25,75.05 62.25,84.5 v62.12,84.5
19.1000BASET_TR3_N  (via drill 0.2)
  Top 0.2: J4.9 21.64,65.06 22.15,64.55 24.1,64.55 24.75,65.2 25.32,65.2 U5.4 U5.7 37.18,65.15 arc90 37.65,65.62 arc-90 38.13,66.1 39.15,66.1 arc-90 39.62,65.62 arc90 40.1,65.15 43.75,65.15 50.85,72.25 62,72.25 v62,72.38 | v63.67,84 63.8,84 63.8,83.7 63.5,83.4 J7.5
  Bottom 0.2: v62,72.38 62,72.25 62.45,72.25 63.8,73.6 63.8,84 v63.67,84
19.1000BASET_TR3_P  (via drill 0.2)
  Top 0.2: J4.10 21.89,63.79 22.15,64.05 24.3,64.05 24.95,64.7 25.32,64.7 U5.5 U5.6 43.95,64.65 51.05,71.75 62,71.75 v62,71.62 | v64.43,84 64.3,84 64.3,83.5 63.9,83.1 J7.3
  Bottom 0.2: v62,71.62 62,71.75 62.65,71.75 64.3,73.4 64.3,84 v64.43,84
19.CAM0_C_N  (via drill 0.2)
  Top 0.2: J10.1_8 110.25,46.02 110.25,47.35 109.5,48.1 102.6,48.1 97.3,42.8 89.85,42.8 89.25,42.2 89.25,40 88.65,39.4 88.24,39.4 arc90 87.26,38.42 87.26,38.01 arc-90 86.79,37.53 86.78,37.53 arc-90 86.31,38.01 86.31,38.42 arc90 85.33,39.4 85.33,39.4 arc90 84.35,38.42 84.35,38.01 arc-90 83.88,37.53 83.87,37.53 arc-90 83.4,38.01 83.4,38.42 arc90 82.42,39.4 82.42,39.4 arc90 81.44,38.42 81.44,38.01 arc-90 80.97,37.53 80.96,37.53 arc-90 80.48,38.01 80.48,38.42 arc90 79.51,39.4 79.5,39.4 arc90 78.53,38.42 78.53,38.01 arc-90 78.05,37.53 78.05,37.53 arc-90 77.57,38.01 77.57,38.42 arc90 76.6,39.4 76.59,39.4 arc90 75.62,38.42 75.62,38.01 arc-90 75.14,37.53 75.14,37.53 arc-90 74.66,38.01 74.66,38.42 arc90 73.69,39.4 73.68,39.4 arc90 72.7,38.42 72.7,38.01 arc-90 72.23,37.53 72.22,37.53 arc-90 71.75,38.01 71.75,38.42 arc90 70.77,39.4 70.77,39.4 arc90 69.79,38.42 69.79,38.01 arc-90 69.32,37.53 69.31,37.53 arc-90 68.84,38.01 68.84,38.42 arc90 67.86,39.4 67.86,39.4 arc90 66.88,38.42 66.88,38.01 arc-90 66.41,37.53 66.4,37.53 arc-90 65.92,38.01 65.92,38.42 arc90 64.95,39.4 64.5,39.4 v64.5,39.53 | v55.38,42.45 55.25,42.45 55.25,43 56.75,44.5 56.75,44.95 56.7,45 J2.40
  Bottom 0.2: v64.5,39.53 64.5,39.4 56.55,39.4 55.25,40.7 55.25,42.45 v55.38,42.45
19.CAM0_C_P  (via drill 0.2)
  Top 0.2: J10.1_9 109.75,46.02 109.75,47.15 109.3,47.6 102.8,47.6 97.5,42.3 90.05,42.3 89.75,42 89.75,39.8 88.85,38.9 88.24,38.9 arc90 87.76,38.42 87.76,38.01 arc-90 86.79,37.03 86.78,37.03 arc-90 85.81,38.01 85.81,38.42 arc90 85.33,38.9 85.33,38.9 arc90 84.85,38.42 84.85,38.01 arc-90 83.88,37.03 83.87,37.03 arc-90 82.9,38.01 82.9,38.42 arc90 82.42,38.9 82.42,38.9 arc90 81.94,38.42 81.94,38.01 arc-90 80.97,37.03 80.96,37.03 arc-90 79.98,38.01 79.98,38.42 arc90 79.51,38.9 79.5,38.9 arc90 79.03,38.42 79.03,38.01 arc-90 78.05,37.03 78.05,37.03 arc-90 77.07,38.01 77.07,38.42 arc90 76.6,38.9 76.59,38.9 arc90 76.12,38.42 76.12,38.01 arc-90 75.14,37.03 75.14,37.03 arc-90 74.16,38.01 74.16,38.42 arc90 73.69,38.9 73.68,38.9 arc90 73.2,38.42 73.2,38.01 arc-90 72.23,37.03 72.22,37.03 arc-90 71.25,38.01 71.25,38.42 arc90 70.77,38.9 70.77,38.9 arc90 70.29,38.42 70.29,38.01 arc-90 69.32,37.03 69.31,37.03 arc-90 68.34,38.01 68.34,38.42 arc90 67.86,38.9 67.86,38.9 arc90 67.38,38.42 67.38,38.01 arc-90 66.41,37.03 66.4,37.03 arc-90 65.42,38.01 65.42,38.42 arc90 64.95,38.9 64.5,38.9 v64.5,38.77 | v54.62,42.45 54.75,42.45 54.75,43.2 56.25,44.7 56.25,44.95 56.3,45 J2.42
  Bottom 0.2: v64.5,38.77 64.5,38.9 56.35,38.9 54.75,40.5 54.75,42.45 v54.62,42.45
19.CAM0_D1_N  (via drill 0.2)
  Top 0.2: J10.1_2 116.25,46.02 116.25,47.15 116.75,47.65 118.5,47.65 119.35,46.8 119.35,41.4 117.4,39.45 101.55,39.45 98.2,36.1 95.54,36.1 arc-90 95.06,36.58 95.06,36.59 arc90 94.59,37.06 94.55,37.06 arc90 94.08,36.59 94.08,36.58 arc-90 93.6,36.1 93.56,36.1 arc-90 93.09,36.58 93.09,36.59 arc90 92.61,37.06 92.58,37.06 arc90 92.1,36.59 92.1,36.58 arc-90 91.62,36.1 91.59,36.1 arc-90 91.11,36.58 91.11,36.59 arc90 90.64,37.06 90.6,37.06 arc90 90.12,36.59 90.12,36.58 arc-90 89.65,36.1 64.5,36.1 v64.5,36.23 | v58.75,36.23 58.75,36.1 58,36.1 57.45,36.65 57.45,38.65 59.15,40.35 59.15,44.95 59.1,45 J2.28
  Bottom 0.2: v64.5,36.23 64.5,36.1 58.75,36.1 v58.75,36.23
19.CAM0_D1_P  (via drill 0.2)
  Top 0.2: J10.1_3 115.75,46.02 115.75,47.35 116.55,48.15 118.7,48.15 119.85,47 119.85,41.2 117.6,38.95 101.75,38.95 98.4,35.6 64.5,35.6 v64.5,35.47 | v58.75,35.47 58.75,35.6 57.8,35.6 56.95,36.45 56.95,38.85 58.65,40.55 58.65,44.95 58.7,45 J2.30
  Bottom 0.2: v64.5,35.47 64.5,35.6 58.75,35.6 v58.75,35.47
19.CAM0_D2_N  (via drill 0.2)
  Top 0.2: J10.1_5 113.25,46.02 113.25,47.2 111.05,49.4 101.85,49.4 101.05,48.6 98.45,48.6 96.25,46.4 96.25,45 95.4,44.15 88.2,44.15 85.5,41.45 73.95,41.45 arc-90 73.47,41.92 73.47,44.73 arc90 72.5,45.7 72.48,45.7 arc90 71.5,44.73 71.5,41.92 arc-90 71.03,41.45 71,41.45 arc-90 70.53,41.92 70.53,44.73 arc90 69.55,45.7 69.53,45.7 arc90 68.56,44.73 68.56,41.92 arc-90 68.08,41.45 68.06,41.45 arc-90 67.58,41.92 67.58,44.73 arc90 66.61,45.7 66.59,45.7 arc90 65.61,44.73 65.61,41.92 arc-90 65.14,41.45 64.5,41.45 v64.5,41.58 | v57.73,42.5 57.6,42.5 57.6,43.6 57.9,43.9 J2.34
  Bottom 0.2: v64.5,41.58 64.5,41.45 58.3,41.45 57.6,42.15 57.6,42.5 v57.73,42.5
19.CAM0_D2_P  (via drill 0.2)
  Top 0.2: J10.1_6 112.75,46.02 112.75,47 110.85,48.9 102.05,48.9 101.25,48.1 98.65,48.1 96.75,46.2 96.75,44.8 95.6,43.65 88.4,43.65 85.7,40.95 73.95,40.95 arc-90 72.97,41.92 72.97,44.73 arc90 72.5,45.2 72.48,45.2 arc90 72,44.73 72,41.92 arc-90 71.03,40.95 71,40.95 arc-90 70.03,41.92 70.03,44.71 arc90 69.55,45.18 69.53,45.18 arc90 69.06,44.71 69.06,41.92 arc-90 68.08,40.95 68.06,40.95 arc-90 67.08,41.92 67.08,44.73 arc90 66.61,45.2 66.59,45.2 arc90 66.11,44.73 66.11,41.92 arc-90 65.14,40.95 64.5,40.95 v64.5,40.82 | v56.97,42.5 57.1,42.5 57.1,43.8 57.5,44.2 J2.36
  Bottom 0.2: v64.5,40.82 64.5,40.95 58.1,40.95 57.1,41.95 57.1,42.5 v56.97,42.5
19.CAM1_C_N  (via drill 0.2)
  Top 0.2: J9.1_8 110.25,56.02 110.25,57.1 109.45,57.9 102.75,57.9 101.9,57.05 101.9,51.65 100.5,50.25 87.95,50.25 86.6,48.9 86.6,45.7 84.2,43.3 77.55,43.3 76.35,44.5 76.35,46.3 74.4,48.25 71,48.25 69.7,49.55 69.7,49.9 67.85,51.75 59.1,51.75 57.75,53.1 57.75,53.5 v57.88,53.5 | v57.88,51 57.75,51 57.75,50.7 59.15,49.3 59.15,49 59.1,48.95 J2.27
  Bottom 0.2: v57.88,53.5 57.75,53.5 57.75,51 v57.88,51
19.CAM1_C_P  (via drill 0.2)
  Top 0.2: J9.1_9 109.75,56.02 109.75,56.9 109.25,57.4 102.95,57.4 102.4,56.85 102.4,51.45 100.7,49.75 88.15,49.75 87.1,48.7 87.1,45.5 84.4,42.8 77.35,42.8 75.85,44.3 75.85,46.1 74.2,47.75 70.8,47.75 69.2,49.35 69.2,49.7 67.65,51.25 58.9,51.25 57.25,52.9 57.25,53.5 v57.12,53.5 | v57.12,51 57.25,51 57.25,50.5 58.65,49.1 58.65,49 58.7,48.95 J2.29
  Bottom 0.2: v57.12,53.5 57.25,53.5 57.25,51 v57.12,51
19.CAM1_D1_N  (via drill 0.2)
  Top 0.2: J9.1_2 116.25,56.02 116.25,57.8 113.85,60.2 100.9,60.2 98.95,58.25 98.95,54.4 98.35,53.8 82.8,53.8 81.5,55.1 61.9,55.1 61.55,55.45 61.55,56 v61.68,56 | v61.68,49.5 61.55,49.5 61.55,49.3 61.5,49.25 J2.15
  Bottom 0.2: v61.68,56 61.55,56 61.55,55.01 arc90 62.02,54.54 63.79,54.54 arc-90 64.76,53.56 64.76,53.2 arc-90 63.79,52.23 62.02,52.23 arc90 61.55,51.75 61.55,49.5 v61.68,49.5
19.CAM1_D1_P  (via drill 0.2)
  Top 0.2: J9.1_3 115.75,56.02 115.75,57.6 113.65,59.7 101.1,59.7 99.45,58.05 99.45,54.2 98.55,53.3 82.6,53.3 81.3,54.6 61.7,54.6 61.05,55.25 61.05,56 v60.92,56 | v60.92,49.5 61.05,49.5 61.05,49.3 61.1,49.25 J2.17
  Bottom 0.2: v60.92,56 61.05,56 61.05,55.01 arc90 62.02,54.04 63.79,54.04 arc-90 64.26,53.56 64.26,53.2 arc-90 63.79,52.73 62.02,52.73 arc90 61.05,51.75 61.05,49.5 v60.92,49.5
19.CAM1_D2_N  (via drill 0.2)
  Top 0.2: J9.1_5 113.25,56.02 113.25,57.35 111.6,59 101.6,59 100.4,57.8 100.4,53.3 98.9,51.8 81.4,51.8 79.95,53.25 78.2,53.25 arc90 77.22,52.27 77.22,51.58 arc-90 76.75,51.11 76.35,51.11 arc-90 75.88,51.58 75.88,52.27 arc90 74.9,53.25 74.5,53.25 arc90 73.53,52.27 73.53,51.58 arc-90 73.05,51.11 72.65,51.11 arc-90 72.17,51.58 72.17,52.27 arc90 71.2,53.25 60.75,53.25 59.5,54.5 59.5,55.2 v59.63,55.2 | v60.33,50.55 60.2,50.55 60.2,49.25 60.3,49.15 J2.21
  Bottom 0.2: v59.63,55.2 59.5,55.2 59.5,54.6 60.2,53.9 60.2,50.55 v60.33,50.55
19.CAM1_D2_P  (via drill 0.2)
  Top 0.2: J9.1_6 112.75,56.02 112.75,57.15 111.4,58.5 101.8,58.5 100.9,57.6 100.9,53.1 99.1,51.3 81.2,51.3 79.75,52.75 78.2,52.75 arc90 77.72,52.27 77.72,51.58 arc-90 76.75,50.61 76.35,50.61 arc-90 75.38,51.58 75.38,52.25 arc90 74.9,52.73 74.5,52.73 arc90 74.03,52.25 74.03,51.58 arc-90 73.05,50.61 72.65,50.61 arc-90 71.67,51.58 71.67,52.27 arc90 71.2,52.75 60.55,52.75 59,54.3 59,55.2 v58.87,55.2 | v59.57,50.55 59.7,50.55 59.7,49.25 59.9,49.05 J2.23
  Bottom 0.2: v58.87,55.2 59,55.2 59,54.4 59.7,53.7 59.7,50.55 v59.57,50.55
19.DSI1_C_N  (via drill 0.2)
  Top 0.2: J1.1_5 115.88,28.2 114.5,28.2 110,32.7 73.85,32.7 72.78,31.64 arc-90 72.11,31.64 arc90 71.44,31.64 70.72,30.92 arc90 70.72,30.25 arc-90 70.72,29.58 66.3,25.15 45.9,25.15 45.2,25.85 45.2,27.05 v45.33,27.05 | v46.28,50.5 46.15,50.5 46.15,50.3 47.15,49.3 47.15,49 47.1,48.95 J2.87
  Bottom 0.2: v45.33,27.05 45.2,27.05 45.2,44.6 46.15,45.55 46.15,50.5 v46.28,50.5
19.DSI1_C_P  (via drill 0.2)
  Top 0.2: J1.1_6 115.88,27.7 114.3,27.7 109.8,32.2 74.05,32.2 66.5,24.65 45.7,24.65 44.7,25.65 44.7,27.05 v44.57,27.05 | v45.52,50.5 45.65,50.5 45.65,50.1 46.65,49.1 46.65,49 46.7,48.95 J2.89
  Bottom 0.2: v44.57,27.05 44.7,27.05 44.7,44.8 45.65,45.75 45.65,50.5 v45.52,50.5
19.DSI1_D1_N  (via drill 0.2)
  Top 0.2: J1.1_8 115.88,25.2 113.85,25.2 112.55,26.5 112.55,28.2 109.95,30.8 98.67,30.8 arc90 97.69,29.82 97.69,29.65 arc-90 97.22,29.17 96.39,29.17 arc-90 95.92,29.65 95.92,29.82 arc90 94.94,30.8 94.12,30.8 arc90 93.15,29.82 93.15,29.65 arc-90 92.67,29.17 91.85,29.17 arc-90 91.38,29.65 91.38,29.82 arc90 90.4,30.8 75.05,30.8 67.3,23.05 52,23.05 v52,23.18 | v49.68,50 49.55,50 49.55,49.1 49.5,49.05 J2.75
  Bottom 0.2: v52,23.18 52,23.05 51.4,23.05 49.55,24.9 49.55,50 v49.68,50
19.DSI1_D1_P  (via drill 0.2)
  Top 0.2: J1.1_9 115.88,24.7 113.65,24.7 112.05,26.3 112.05,28 109.75,30.3 98.67,30.3 arc90 98.19,29.82 98.19,29.65 arc-90 97.22,28.67 96.39,28.67 arc-90 95.42,29.65 arc90 94.94,30.12 94.12,30.12 arc90 93.65,29.65 arc-90 92.67,28.67 91.85,28.67 arc-90 90.88,29.65 90.88,29.82 arc90 90.4,30.3 75.25,30.3 67.5,22.55 52,22.55 v52,22.42 | v48.92,50 49.05,50 49.05,49.1 49.1,49.05 J2.77
  Bottom 0.2: v52,22.42 52,22.55 51.2,22.55 49.05,24.7 49.05,50 v48.92,50
19.DSI1_D2_N  (via drill 0.2)
  Top 0.2: J1.1_2 115.88,31.2 114.4,31.2 111.05,34.55 108.56,34.55 arc-90 108.09,35.02 108.09,35.55 arc90 107.11,36.53 106.93,36.53 arc90 105.95,35.55 105.95,35.02 arc-90 105.48,34.55 105.29,34.55 arc-90 104.81,35.02 104.81,35.55 arc90 103.84,36.53 103.65,36.53 arc90 102.67,35.55 102.67,35.02 arc-90 102.2,34.55 71.65,34.55 64.4,27.3 48.45,27.3 47.5,28.25 47.5,28.55 v47.63,28.55 | v47.93,51.05 47.8,51.05 47.8,50.1 48.3,49.6 J2.81
  Bottom 0.2: v47.63,28.55 47.5,28.55 47.5,48.3 47.8,48.6 47.8,51.05 v47.93,51.05
19.DSI1_D2_P  (via drill 0.2)
  Top 0.2: J1.1_3 115.88,30.7 114.2,30.7 110.85,34.05 108.56,34.05 arc-90 107.59,35.02 107.59,35.55 arc90 107.11,36.03 106.93,36.03 arc90 106.45,35.55 106.45,35.02 arc-90 105.48,34.05 105.29,34.05 arc-90 104.31,35.02 104.31,35.12 arc90 103.84,35.59 103.65,35.59 arc90 103.17,35.12 103.17,35.02 arc-90 102.2,34.05 71.85,34.05 64.6,26.8 48.25,26.8 47,28.05 47,28.55 v46.87,28.55 | v47.17,51.05 47.3,51.05 47.3,49.9 47.9,49.3 J2.83
  Bottom 0.2: v46.87,28.55 47,28.55 47,48.5 47.3,48.8 47.3,51.05 v47.17,51.05
19.GPIO2_GPIO  (via drill 0.2)
  Top 0.102: v50.77,80.23 52.7,80.23 53.05,79.88 53.05,79.47 J7.58
  S3 0.102: v50.77,7.69 v50.77,76.83
  S14 0.102: v50.77,7.69 88.77,7.69 90.54,5.91 U4.3
  Bottom 0.102: v50.77,76.83 v50.77,80.23
19.GPIO3_GPIO  (via drill 0.2)
  Top 0.102: J7.56 v53.5,80.25
  S3 0.102: v82.1,69.9 82.1,58.75 90.55,50.3 94.95,50.3 97.15,48.1 97.15,12.9 96.25,12 89.2,12 88.05,10.85 U4.5
  Bottom 0.102: v53.5,80.25 53.5,75 59.05,69.45 81.65,69.45 v82.1,69.9
19.GPIO4_GPIO  (via drill 0.2)
  Top 0.102: J7.54 53.95,79.51 53.95,79.9 53.96,79.91 v53.96,80.73
  S3 0.102: v67.89,70.22 67.89,63.32 78.71,52.49 78.71,40.76 85.46,34 85.46,5.91 U4.7
  Bottom 0.102: v53.96,80.73 54.1,80.59 54.1,76.55 60.93,69.72 67.39,69.72 v67.89,70.22
19.GPIO5_GPIO  (via drill 0.2)
  Top 0.102: v58.84,78.71 58.29,78.71 57.93,79.06 57.93,79.42 J7.34
  S3 0.102: v58.84,78.71 58.84,77.23 61.18,74.9 v64.94,74.9 | v64.94,55.75 64.94,47.41 65.4,46.96 65.4,8.4 63.77,6.78 58.44,6.78 57.58,5.91 U4.29
  S14 0.102: v64.94,55.75 v64.94,74.9
19.GPIO6_GPIO  (via drill 0.2)
  Top 0.102: v58.9,80.23 58.74,80.08 58.74,79.47 J7.30
  S3 0.102: v58.9,80.23 59.15,80.23 59.81,79.57 62.05,79.57 v64.94,76.68 | v63.72,55.75 63.72,48.94 59.35,44.57 59.35,10.23 55.03,5.91 U4.31
  S14 0.102: v64.94,76.68 64.94,75.51 63.72,74.29 v63.72,55.75
19.GPIO7_GPIO  (via drill 0.2)
  Top 0.102: v57.32,83.28 57.12,83.08 57.12,82.57 J7.37
  S3 0.102: v64.18,71.04 64.18,47.41 63.62,46.86 v63.62,7.23
  S14 0.102: v63.62,7.23 63.62,4.34 62.66,3.37 U4.26
  Bottom 0.102: v57.32,83.28 57.32,81.81 57.93,81.2 57.93,80.74 57.83,80.64 57.83,79.01 59,77.84 59,73.78 61.74,71.04 v64.18,71.04
19.GPIO8_GPIO  (via drill 0.2)
  Top 0.102: v56.71,83.28 56.71,82.57 J7.39
  S3 0.102: v56.71,83.28 57.52,82.47 62.71,82.47 64.99,80.18 67.53,80.18 68.34,79.37 v68.34,72.66 | v68.34,55.75 68.34,55.44 66.97,54.07 66.97,7.23 v67.23,6.98
  S14 0.102: v68.34,55.75 v68.34,72.66 | v67.23,6.98 67.23,6.62 65.19,4.59 65.19,3.37 U4.24
19.GPIO9_GPIO  (via drill 0.2)
  Top 0.102: v56.71,80.23 56.71,79.47 J7.40
  S3 0.102: U4.21 67.68,5.91 66.77,6.83 66.77,71.24 65.04,72.97 61.74,72.97 61.64,72.87 60.27,72.87 59.91,73.22 59.91,75.1 59.01,76 57.54,76 v56.71,76.83
  Bottom 0.102: v56.71,76.83 v56.71,80.23
19.GPIO10_GPIO  (via drill 0.2)
  Top 0.102: v56.86,80.84 56.71,80.84 55.95,80.08 55.95,79.47 J7.44
  S3 0.102: v56.86,80.84 57.02,80.84 58.49,79.37 61.64,79.37 64.79,76.22 v66.31,76.22 | v67.43,53.92 67.43,8.71 70.22,5.91 U4.19
  S14 0.102: v66.31,76.22 66.31,55.03 v67.43,53.92
19.GPIO11_GPIO  (via drill 0.2)
  Top 0.102: v65.86,71.55 65.86,79.37 64.43,80.79 61.18,80.79 60.57,81.4 58.59,81.4 57.12,79.93 57.12,79.47 J7.38
  S3 0.102: v65.86,71.55 65.86,6.57 65.19,5.91 U4.23
19.GPIO12_GPIO  (via drill 0.2)
  Top 0.102: v58.29,83.28 58.39,83.18 58.39,83.03 58.34,82.97 58.34,82.57 J7.31
  S3 0.102: v54.68,76.83 54.68,49.8 54.78,49.7 54.78,43.45 54.02,42.69 v54.02,7.23
  S14 0.102: v54.02,7.23 54.02,4.34 54.98,3.37 U4.32
  Bottom 0.102: v58.29,83.28 57.93,83.28 57.47,83.74 56.56,83.74 55.95,83.13 55.95,81.65 54.68,80.38 v54.68,76.83
19.GPIO13_GPIO  (via drill 0.2)
  Top 0.102: v59.45,80.54 59.45,80.18 59.15,79.88 59.15,79.47 J7.28
  S3 0.102: v59.45,74.95 59.45,56.66 56,53.21 56,8.6 53.31,5.91 52.49,5.91 U4.33
  Bottom 0.102: v59.45,74.95 v59.45,80.54
19.GPIO16_GPIO  (via drill 0.2)
  Top 0.102: J7.29 58.74,82.57 58.74,83.74 58.43,84.05 51.39,84.05 v51.12,83.79
  S3 0.102: v46.25,78.66 46.25,53.56 48.53,51.28 48.53,50.46 48.33,50.26 v48.33,4.69
  S14 0.102: v51.12,83.79 51.12,81.91 48.33,79.11 46.7,79.11 v46.25,78.66 | v48.33,4.69 48.58,4.69 49.9,3.37 U4.36
19.GPIO17_GPIO  (via drill 0.2)
  Top 0.102: J7.50 54.68,79.47 54.68,80.97 54.35,81.3 53.95,81.3 53.85,81.2 53.8,81.2 53.7,81.1 53.05,81.1 52.9,81.25 v52.9,81.7
  S3 0.102: v52.9,81.7 53.05,81.7 53.61,82.26 62.6,82.26 64.89,79.98 67.43,79.98 68.14,79.27 68.14,73.07 67.89,72.81 67.89,72.51 68.19,72.21 v77.08,72.21 | v77.08,53.51 77.08,9.21 80.38,5.91 U4.11
  S14 0.102: v77.08,53.51 v77.08,72.21
19.GPIO18_GPIO  (via drill 0.2)
  Top 0.102: v54.73,83.28 54.73,82.57 J7.49
  S3 0.102: v68.85,73.02 68.85,79.17 67.63,80.38 65.09,80.38 61.74,83.74 56.56,83.74 55.72,82.9 55.11,82.9 v54.73,83.28 | v68.85,53.92 68.85,8.55 73.17,4.23 79.52,4.23 80.38,3.37 U4.12
  S14 0.102: v68.85,53.92 v68.85,73.02
19.GPIO19_GPIO  (via drill 0.2)
  Top 0.102: v59.91,78.66 59.51,79.06 59.51,79.42 J7.26
  S3 0.102: v59.91,76.78 v59.91,78.66 | v50.26,72.87 50.26,6.22 49.95,5.91 U4.35
  S14 0.102: v59.91,76.78 59.91,74.8 57.27,72.15 55.7,72.15 54.98,72.87 v50.26,72.87
19.GPIO20_GPIO  (via drill 0.2)
  Top 0.102: v43.45,76.98 43.45,82.77 44.98,84.3 58.54,84.3 59.1,83.74 59.1,82.57 J7.27
  S3 0.102: v43.45,4.69 v43.45,76.98
  S14 0.102: v43.45,4.69 46.04,4.69 47.36,3.37 U4.38
19.GPIO21_GPIO  (via drill 0.2)
  Top 0.102: v41.98,75.15 41.98,81.6 44.88,84.5 58.64,84.5 59.4,83.74 59.4,83.08 59.45,83.03 59.45,82.57 J7.25
  S3 0.102: v41.98,5 v41.98,75.15
  S14 0.102: v41.98,5 42.54,5 44.16,3.37 44.82,3.37 U4.40
19.GPIO22_GPIO  (via drill 0.2)
  Top 0.102: v55.75,80.49 55.75,80.23 55.54,80.03 55.54,79.47 J7.46
  S3 0.102: v67.43,70.82 67.43,57.27 75.3,49.4 75.3,5.91 U4.15
  Bottom 0.102: v55.75,80.49 55.75,76.73 62.3,70.17 66.78,70.17 v67.43,70.82
19.GPIO23_GPIO  (via drill 0.2)
  Top 0.102: v54.88,81.81 55.09,82.01 55.09,82.52 J7.47
  Top 0.254: R34.2 94.35,38.65 v94.35,38.5
  S3 0.102: v77.69,71.9 v77.69,81.35 | v77.89,53.92 86.12,53.92 93.34,46.7 93.34,39.49 94.3,38.52 v94.35,38.5
  S14 0.102: v94.35,38.5 94.3,38.47 94.3,5.76 92.78,4.23 76.22,4.23 75.36,3.37 U4.16 | v54.88,81.81 55.34,82.26 59.71,82.26 60.62,81.35 v77.69,81.35 | v77.69,71.9 77.69,54.12 v77.89,53.92
  Bottom 0.254: v94.35,38.5 R32.1
19.GPIO24_GPIO  (via drill 0.2)
  Top 0.102: v55.49,81.81 55.49,82.52 J7.45
  S3 0.102: 33.11,4.36 33.09,4.34 30.55,4.34 v30.52,4.37 | 33.11,4.36 36.29,7.54 36.29,70.73 44.67,79.11 53.56,79.11 54.55,80.1 54.55,80.6 55.49,81.54 v55.49,81.81 | 33.11,4.36 34.77,2.71 40.76,2.71 42.28,4.23 70.63,4.23 71.49,3.37 72.76,3.37 U4.18
  Bottom 0.254: C98.1 30.13,5.15 R31.2 30.17,4.72 v30.52,4.37
19.GPIO25_GPIO  (via drill 0.2)
  Top 0.102: v56.25,80.99 56.25,82.52 J7.41
  S3 0.102: v56.25,80.99 56.25,80.08 57.17,79.17 61.54,79.17 v65.4,75.3 | v66.31,4.69 v66.31,53.92
  S14 0.102: v65.4,75.3 65.4,54.83 v66.31,53.92 | v66.31,4.69 67.68,3.32 U4.22
19.GPIO26_GPIO  (via drill 0.2)
  Top 0.102: v59.91,80.94 59.91,79.47 J7.24
  S3 0.102: v45.33,78.45 45.33,51.17 44.93,50.77 44.93,49.7 46.25,48.38 46.25,7.03 47.36,5.91 U4.37
  S14 0.102: v45.33,78.45 45.59,78.2 52.49,78.2 55.75,81.45 57.7,81.45 57.9,81.25 59.6,81.25 v59.91,80.94
19.GPIO27_GPIO  (via drill 0.2)
  Top 0.102: v55.14,80.23 55.14,79.47 J7.48
  S3 0.102: v55.14,80.23 55.14,80.49 56.1,81.45 57.7,81.45 57.85,81.3 58.8,81.3 59,81.5 60.47,81.5 64.84,77.13 66.36,77.13 v66.77,76.73 | v76.47,53.51 76.47,7.28 77.84,5.91 U4.13
  S14 0.102: v66.77,76.73 66.77,55.39 68.7,53.46 76.42,53.46 v76.47,53.51
19.GPIO_CAMERA_GPIO  (via drill 0.2)
  Top 0.102: v45.13,83.84 45.13,82.57 J7.97 | v107.36,54.68 107.46,54.78 107.46,56 J9.1_11 | v107.46,44.67 107.46,45.99 J10.1_11
  S3 0.102: v45.13,83.84 46.7,83.84 47.97,85.11 92.53,85.11 96.39,81.25 96.39,59.86 100.86,55.39 106.65,55.39 v107.36,54.68 107.46,54.58 v107.46,44.67
19.HDMI0_CEC  (via drill 0.2)
  Top 0.102: U$29.2 104.2,64.7 v103.8,65.1 | v54.32,49.55 54.32,48.58 J2.51
  S14 0.102: v54.32,49.55 57.73,49.55 60.83,52.65 103.24,52.65 104.36,53.77 104.36,64.53 v103.8,65.09 v103.8,65.1
  Bottom 0.102: RP3.4 104.6,65.1 v103.8,65.1
19.HDMI0_CLOCK_N  (via drill 0.2)
  Top 0.2: L4.2 107.03,68.08 107,68.1 104,68.1 | v104,67.97 104,68.1 | 104,68.1 101.45,68.1 97.35,72.2 86.25,72.2 83.19,69.14 arc90 83.19,68.47 84.73,66.93 arc-90 84.73,65.55 84.71,65.53 arc-90 83.33,65.53 81.79,67.07 arc90 81.12,67.07 81.1,67.04 arc90 81.1,66.37 82.64,64.83 arc-90 82.64,63.45 82.61,63.43 arc-90 81.23,63.43 79.69,64.97 arc90 79.02,64.97 79,64.94 arc90 79,64.27 80.54,62.73 arc-90 80.54,61.35 80.51,61.33 arc-90 79.13,61.33 77.59,62.87 arc90 76.92,62.87 76.9,62.85 arc90 76.9,62.17 78.44,60.63 arc-90 78.44,59.26 78.42,59.23 arc-90 77.04,59.23 75.5,60.77 arc90 74.83,60.77 74.8,60.75 arc90 74.8,60.08 76.34,58.54 arc-90 76.34,57.16 76.32,57.13 arc-90 74.94,57.13 73.4,58.67 arc90 72.73,58.67 71.2,57.15 48.55,57.15 43.25,51.85 43.25,45.3 44.05,44.5 46.4,44.5 46.7,44.8 J2.90
  Bottom 0.2: v104,67.97 104,68.1 104.5,68.1 104.93,68.53 U8.9
19.HDMI0_CLOCK_P  (via drill 0.2)
  Top 0.2: L4.3 107.03,68.62 107,68.6 104,68.6 | 104,68.6 v104,68.73 | 104,68.6 101.65,68.6 97.55,72.7 86.05,72.7 82.84,69.5 arc90 82.84,68.12 84.38,66.58 arc-90 84.38,65.91 84.36,65.88 arc-90 83.69,65.88 82.14,67.42 arc90 80.77,67.42 80.74,67.4 arc90 80.74,66.02 81.4,65.36 arc-90 81.4,64.69 81.37,64.67 arc-90 80.7,64.67 80.05,65.32 arc90 78.67,65.32 78.64,65.3 arc90 78.64,63.92 80.18,62.38 arc-90 80.18,61.71 80.16,61.68 arc-90 79.49,61.68 77.95,63.22 arc90 76.57,63.22 76.55,63.2 arc90 76.55,61.82 78.08,60.28 arc-90 78.08,59.61 78.06,59.59 arc-90 77.39,59.59 75.85,61.12 arc90 74.47,61.12 74.45,61.1 arc90 74.45,59.72 75.99,58.18 arc-90 75.99,57.51 75.96,57.49 arc-90 75.29,57.49 73.75,59.03 arc90 72.37,59.03 71,57.65 48.35,57.65 42.75,52.05 42.75,45.1 43.85,44 46.6,44 47.1,44.5 J2.88
  Bottom 0.2: 105.6,69.2 U8.10 104.87,69.17 104.3,68.6 104,68.6 v104,68.73
19.HDMI0_D0_N  (via drill 0.2)
  Top 0.2: L3.2 107.03,69.62 107,69.65 104,69.65 | v104,69.52 104,69.65 | 104,69.65 102,69.65 98.05,73.6 84.35,73.6 71.7,60.95 70.18,60.95 arc90 69.7,60.48 69.7,59.78 arc-90 68.73,58.81 68.71,58.81 arc-90 67.73,59.78 67.73,60.48 arc90 67.26,60.95 67.24,60.95 arc90 66.77,60.48 66.77,59.78 arc-90 65.79,58.81 65.78,58.81 arc-90 64.8,59.78 64.8,60.48 arc90 64.33,60.95 64.31,60.95 arc90 63.83,60.48 63.83,59.78 arc-90 62.86,58.81 62.84,58.81 arc-90 61.87,59.78 61.87,60.48 arc90 61.39,60.95 61.37,60.95 arc90 60.9,60.48 60.9,59.78 arc-90 59.92,58.81 59.91,58.81 arc-90 58.93,59.78 58.93,60.48 arc90 58.45,60.95 58.44,60.95 arc90 57.96,60.48 57.96,59.78 arc-90 56.99,58.81 56.97,58.81 arc-90 55.99,59.78 55.99,60.48 arc90 55.52,60.95 55.5,60.95 arc90 55.03,60.48 55.03,59.78 arc-90 54.05,58.81 54.03,58.81 arc-90 53.06,59.78 53.06,60.48 arc90 52.59,60.95 52.57,60.95 arc90 52.09,60.48 52.09,59.78 arc-90 51.12,58.81 51.1,58.81 arc-90 50.12,59.78 50.12,60.48 arc90 49.65,60.95 49.25,60.95 41.3,53 41.3,44.55 43.05,42.8 47.2,42.8 47.85,43.45 47.85,44.8 47.9,44.85 J2.84
  Bottom 0.2: 105.6,69.85 U8.11 | U8.11 105.17,69.83 105.1,69.9 | U8.11 104.68,69.83 104.5,69.65 104,69.65 v104,69.52
19.HDMI0_D0_P  (via drill 0.2)